# Altium project iMX6 Rex_V1I1.PrjPcb (part 2 of 3)

## Sheet [06] - CPU - HDMI, LVDS.SchDoc
size A2; DocumentNumber: 6; SheetNumber: 6; SheetTotal: 20
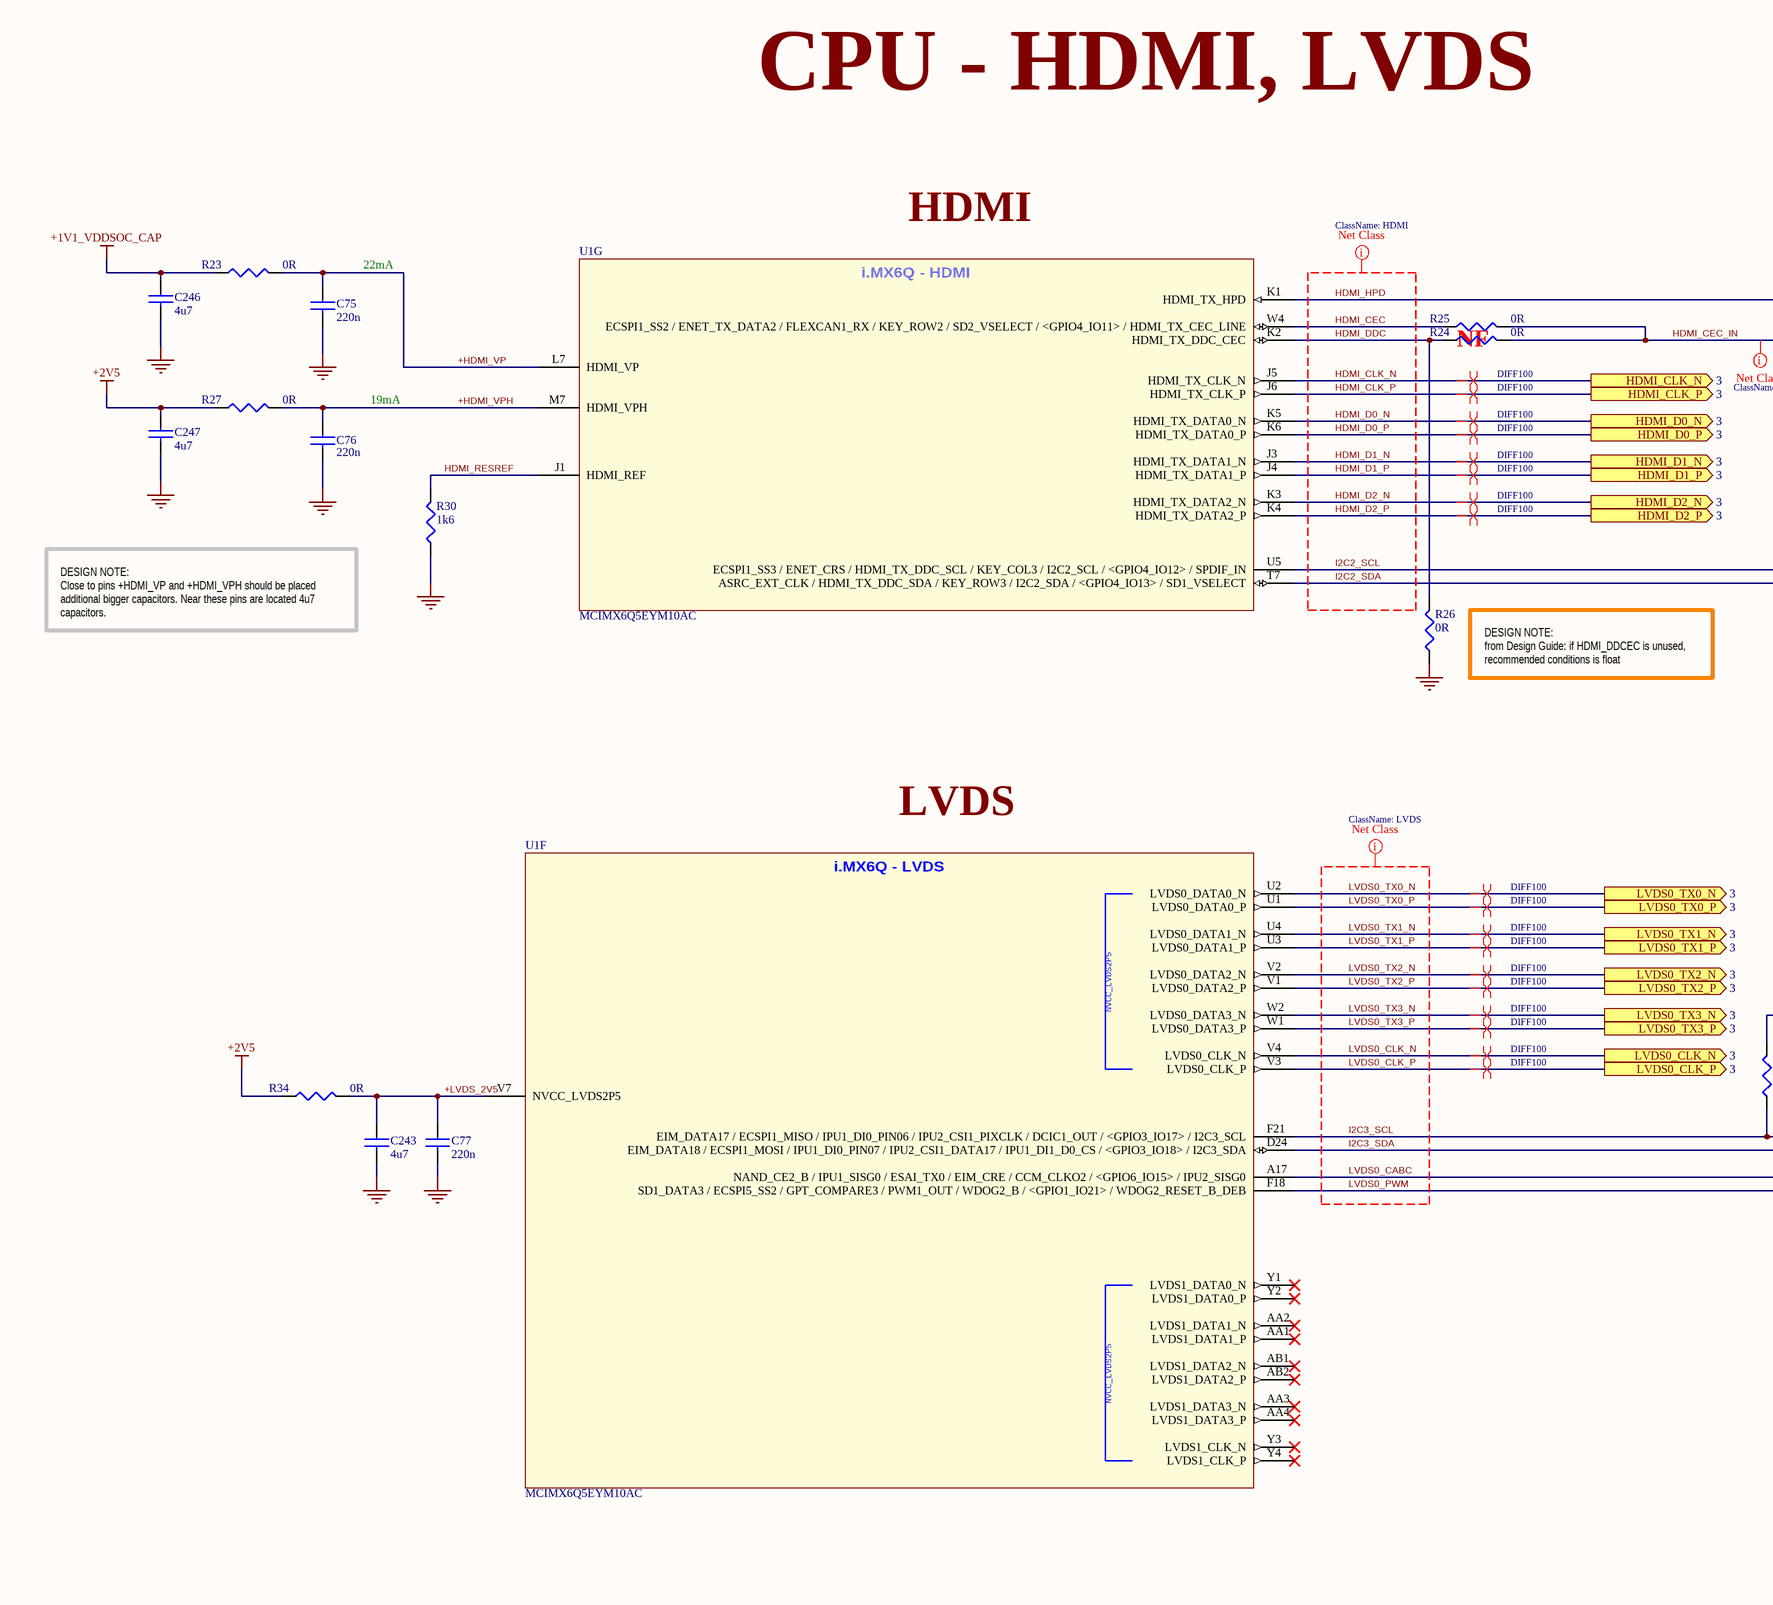
[diagram p4: [06] - CPU - HDMI, LVDS.SchDoc, left]
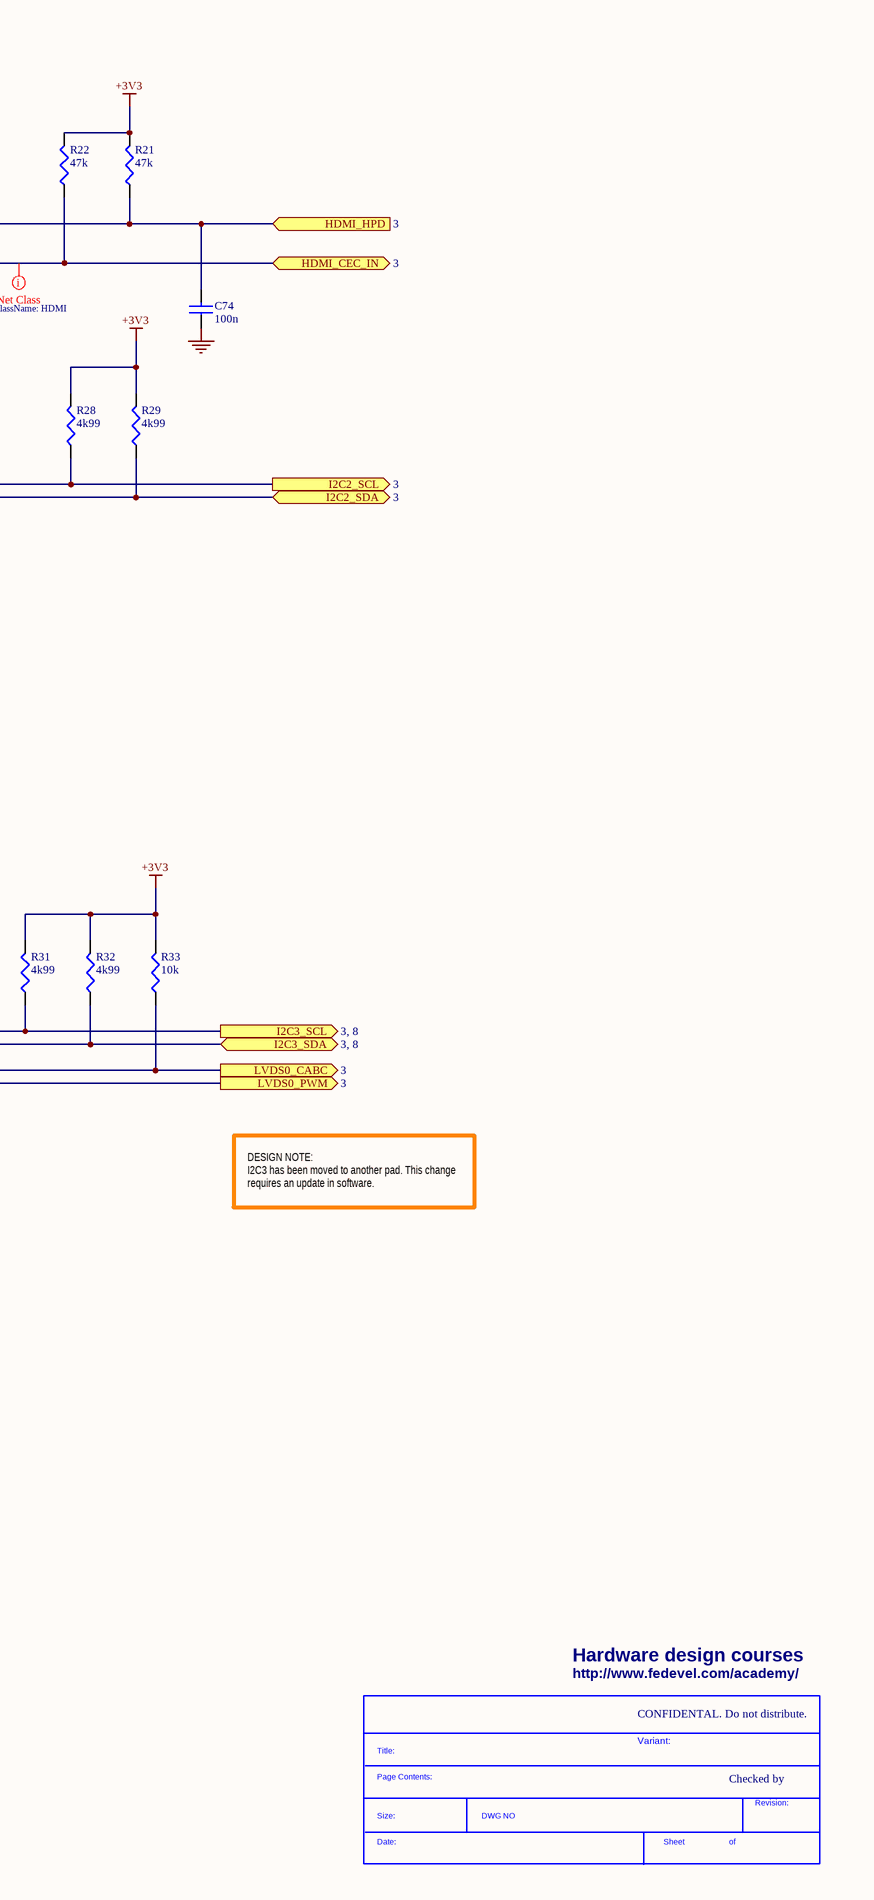
[diagram p5: [06] - CPU - HDMI, LVDS.SchDoc, right]

### Parts
(Parts that share a designator on the sheet are numbered #1, #2 ... from top to bottom, then left to right.)
*#3  SDTitleBlock  (value not drawn)  (graphical)
C74  100n  [C0402]
C75  220n  [C0402]
C76  220n  [C0402]
C77  220n  [C0402]
C243  4u7  [C0402]
C246  4u7  [C0402]
C247  4u7  [C0402]
R21  47k  [R0402]
R22  47k  [R0402]
R23  0R  [R0402]
R24  0R  [R0402]
R25  0R  [R0402]
R26  0R  [R0402]
R27  0R  [R0402]
R28  4k99  [R0402]
R29  4k99  [R0402]
R30  1k6  [R0402]
R31  4k99  [R0402]
R32  4k99  [R0402]
R33  10k  [R0402]
R34  0R  [R0402]
U1  MCIMX6Q5EYM10AC  [PBGA624]  (parts F,G of 15)

### Ports
HDMI_CEC_IN (bidir, see 3), HDMI_CLK_N (out, see 3), HDMI_CLK_P (out, see 3), HDMI_D0_N (out, see 3), HDMI_D0_P (out, see 3), HDMI_D1_N (out, see 3), HDMI_D1_P (out, see 3), HDMI_D2_N (out, see 3), HDMI_D2_P (out, see 3), HDMI_HPD (in, see 3), I2C2_SCL (out, see 3), I2C2_SDA (bidir, see 3), I2C3_SCL (see 3, 8), I2C3_SDA (bidir, see 3, 8), LVDS0_CABC (out, see 3), LVDS0_CLK_N (out, see 3), LVDS0_CLK_P (out, see 3), LVDS0_PWM (out, see 3), LVDS0_TX0_N (out, see 3), LVDS0_TX0_P (out, see 3), LVDS0_TX1_N (out, see 3), LVDS0_TX1_P (out, see 3), LVDS0_TX2_N (out, see 3), LVDS0_TX2_P (out, see 3), LVDS0_TX3_N (out, see 3), LVDS0_TX3_P (out, see 3)

### Nets
+1V1_VDDSOC_CAP: C246.1 R23.1
+2V5: C247.1 R27.1 R34.1
+3V3: R21.2 R22.2 R28.2 R29.2 R31.2 R32.2 R33.2
GND: C74.1 C75.2 C76.2 C77.2 C243.2 C246.2 C247.2 R26.1 R30.1
+HDMI_VP: C75.1 R23.2 U1.L7(HDMI_VP)
+HDMI_VPH: C76.1 R27.2 U1.M7(HDMI_VPH)
+LVDS_2V5: C77.1 C243.1 R34.2 U1.V7(NVCC_LVDS2P5)
HDMI_CEC: R25.1 U1.W4(ECSPI1_SS2_/_ENET_TX_DATA2_/_FLEXCAN1_RX_/_KEY_ROW2_/_SD2_VSELECT_/_<GPIO4_IO11>_/_HDMI_TX_CEC_LINE)
HDMI_CEC_IN: R22.1 R24.2 R25.2 ; port HDMI_CEC_IN
HDMI_CLK_N: U1.J5(HDMI_TX_CLK_N) ; port HDMI_CLK_N
HDMI_CLK_P: U1.J6(HDMI_TX_CLK_P) ; port HDMI_CLK_P
HDMI_D0_N: U1.K5(HDMI_TX_DATA0_N) ; port HDMI_D0_N
HDMI_D0_P: U1.K6(HDMI_TX_DATA0_P) ; port HDMI_D0_P
HDMI_D1_N: U1.J3(HDMI_TX_DATA1_N) ; port HDMI_D1_N
HDMI_D1_P: U1.J4(HDMI_TX_DATA1_P) ; port HDMI_D1_P
HDMI_D2_N: U1.K3(HDMI_TX_DATA2_N) ; port HDMI_D2_N
HDMI_D2_P: U1.K4(HDMI_TX_DATA2_P) ; port HDMI_D2_P
HDMI_DDC: R24.1 R26.2 U1.K2(HDMI_TX_DDC_CEC)
HDMI_HPD: C74.2 R21.1 U1.K1(HDMI_TX_HPD) ; port HDMI_HPD
HDMI_RESREF: R30.2 U1.J1(HDMI_REF)
I2C2_SCL: R28.1 U1.U5(ECSPI1_SS3_/_ENET_CRS_/_HDMI_TX_DDC_SCL_/_KEY_COL3_/_I2C2_SCL_/_<GPIO4_IO12>_/_SPDIF_IN) ; port I2C2_SCL
I2C2_SDA: R29.1 U1.T7(ASRC_EXT_CLK_/_HDMI_TX_DDC_SDA_/_KEY_ROW3_/_I2C2_SDA_/_<GPIO4_IO13>_/_SD1_VSELECT) ; port I2C2_SDA
I2C3_SCL: R31.1 U1.F21(EIM_DATA17_/_ECSPI1_MISO_/_IPU1_DI0_PIN06_/_IPU2_CSI1_PIXCLK_/_DCIC1_OUT_/_<GPIO3_IO17>_/_I2C3_SCL) ; port I2C3_SCL
I2C3_SDA: R32.1 U1.D24(EIM_DATA18_/_ECSPI1_MOSI_/_IPU1_DI0_PIN07_/_IPU2_CSI1_DATA17_/_IPU1_DI1_D0_CS_/_<GPIO3_IO18>_/_I2C3_SDA) ; port I2C3_SDA
LVDS0_CABC: R33.1 U1.A17(NAND_CE2_B_/_IPU1_SISG0_/_ESAI_TX0_/_EIM_CRE_/_CCM_CLKO2_/_<GPIO6_IO15>_/_IPU2_SISG0) ; port LVDS0_CABC
LVDS0_CLK_N: U1.V4(LVDS0_CLK_N) ; port LVDS0_CLK_N
LVDS0_CLK_P: U1.V3(LVDS0_CLK_P) ; port LVDS0_CLK_P
LVDS0_PWM: U1.F18(SD1_DATA3_/_ECSPI5_SS2_/_GPT_COMPARE3_/_PWM1_OUT_/_WDOG2_B_/_<GPIO1_IO21>_/_WDOG2_RESET_B_DEB) ; port LVDS0_PWM
LVDS0_TX0_N: U1.U2(LVDS0_DATA0_N) ; port LVDS0_TX0_N
LVDS0_TX0_P: U1.U1(LVDS0_DATA0_P) ; port LVDS0_TX0_P
LVDS0_TX1_N: U1.U4(LVDS0_DATA1_N) ; port LVDS0_TX1_N
LVDS0_TX1_P: U1.U3(LVDS0_DATA1_P) ; port LVDS0_TX1_P
LVDS0_TX2_N: U1.V2(LVDS0_DATA2_N) ; port LVDS0_TX2_N
LVDS0_TX2_P: U1.V1(LVDS0_DATA2_P) ; port LVDS0_TX2_P
LVDS0_TX3_N: U1.W2(LVDS0_DATA3_N) ; port LVDS0_TX3_N
LVDS0_TX3_P: U1.W1(LVDS0_DATA3_P) ; port LVDS0_TX3_P

Not connected (* = marked no-connect by the designer): U1 AA1(LVDS1_DATA1_P)* AA2(LVDS1_DATA1_N)* AA3(LVDS1_DATA3_N)* AA4(LVDS1_DATA3_P)* AB1(LVDS1_DATA2_N)* AB2(LVDS1_DATA2_P)* Y1(LVDS1_DATA0_N)* Y2(LVDS1_DATA0_P)* Y3(LVDS1_CLK_N)* Y4(LVDS1_CLK_P)*

### Layout directives
differential pair; net class DIFF100: HDMI_CLK_N, HDMI_CLK_P, HDMI_D0_N, HDMI_D0_P, HDMI_D1_N, HDMI_D1_P, HDMI_D2_N, HDMI_D2_P, LVDS0_CLK_N, LVDS0_CLK_P, LVDS0_TX0_N, LVDS0_TX0_P, LVDS0_TX1_N, LVDS0_TX1_P, LVDS0_TX2_N, LVDS0_TX2_P, LVDS0_TX3_N, LVDS0_TX3_P
net class LVDS: I2C3_SCL, I2C3_SDA, LVDS0_CABC, LVDS0_CLK_N, LVDS0_CLK_P, LVDS0_PWM, LVDS0_TX0_N, LVDS0_TX0_P, LVDS0_TX1_N, LVDS0_TX1_P, LVDS0_TX2_N, LVDS0_TX2_P, LVDS0_TX3_N, LVDS0_TX3_P
net class HDMI: HDMI_CEC, HDMI_CEC_IN, HDMI_CLK_N, HDMI_CLK_P, HDMI_D0_N, HDMI_D0_P, HDMI_D1_N, HDMI_D1_P, HDMI_D2_N, HDMI_D2_P, HDMI_DDC, HDMI_HPD, I2C2_SCL, I2C2_SDA

### Notes on the sheet
- CPU - HDMI, LVDS
- HDMI
- (near C75) 22mA
- NF
- 19mA
- DESIGN NOTE:
  Close to pins +HDMI_VP and +HDMI_VPH should be placed additional bigger capacitors. Near these pins are located 4u7 capacitors.
- DESIGN NOTE:
  from Design Guide: if HDMI_DDCEC is unused, recommended conditions is float
- LVDS
- DESIGN NOTE:
  I2C3 has been moved to another pad. This change requires an update in software.
- Hardware design courses
- http://www.fedevel.com/academy/
- CONFIDENTAL. Do not distribute.
- Variant:
- Checked by
- (in symbol MCIMX6Q5EYM10AC, part F) i.MX6Q - LVDS
- (in symbol MCIMX6Q5EYM10AC, part G) i.MX6Q - HDMI
- (in symbol SDTitleBlock) Title:; Page Contents:; Revision:; Size:; DWG NO; Date:; Sheet; of

### Library data of the parts
C74 = C1005X5R1H104K: CAP CER .10UF 50V X5R 10% 0402; Manufacturer: TDK Corporation; Capacitance: 0.1µF; Value: 100nF; .Checked PCB: used; Description: CAP CER 0.1UF 50V 10% X5R 0402; Category: Capacitors; Supplier Part Number: 445-5942-1-ND; Manufacturer Part Number: C1005X5R1H104K; Operating Temperature: -55°C ~ 85°C; Package / Case: 0402 (1005 Metric); Price 1k [$]: 0.02340; .Checked SCH: used; Voltage - Rated: 50V; Supplier: Digikey; Supplier 1: Digi-Key; Supplier Part Number 1: 445-5942-1-ND; RoHS: RoHS Compliant; Stock 1: 106926; Pricing 1: 1=0.27, 10=0.18, 100=0.072, 250=0.05176, 500=0.0369, 1000=0.027 (USD); Tolerance: ±10%; Temperature Coefficient: X5R; Mounting Type: Surface Mount, MLCC; Applications: General Purpose; Ratings: -; Size / Dimension: 0.039" L x 0.020" W (1.00mm x 0.50mm); Height - Seated (Max): -; Thickness (Max): 0.022" (0.55mm); Lead Spacing: -; Features: -; Packaging: Cut Tape (CT); Lead Style: -; ComponentLink1URL: http://www.tdk.co.jp/tefe02/e412_c.pdf; ComponentLink1Description: http://www.tdk.co.jp/tefe02/e412_c.pdf
C75-C77 = C1005X5R1E224M: CAP CER .22UF 25V X5R 20% 0402; Manufacturer: TDK Corporation; Capacitance: 0.22µF; Value: 220nF; .Checked PCB: used; Description: CAP CER 0.22UF 25V 20% X5R 0402; Category: Capacitors; Supplier Part Number: 445-5945-1-ND; Manufacturer Part Number: C1005X5R1E224M; Operating Temperature: -55°C ~ 85°C; Package / Case: 0402 (1005 Metric); Price 1k [$]: 0.02600; .Checked SCH: used; Voltage - Rated: 25V; Supplier: Digikey; Supplier 1: Digi-Key; Supplier Part Number 1: 445-5945-1-ND; RoHS: RoHS Compliant; Stock 1: 54593; Pricing 1: 1=0.3, 10=0.2, 100=0.08, 250=0.05752, 500=0.041, 1000=0.03 (USD); Tolerance: ±20%; Temperature Coefficient: X5R; Mounting Type: Surface Mount, MLCC; Applications: General Purpose; Ratings: -; Size / Dimension: 0.039" L x 0.020" W (1.00mm x 0.50mm); Height - Seated (Max): -; Thickness (Max): 0.022" (0.55mm); Lead Spacing: -; Features: -; Packaging: Cut Tape (CT); Lead Style: -; ComponentLink1URL: http://www.tdk.co.jp/tefe02/e412_c.pdf; ComponentLink1Description: http://www.tdk.co.jp/tefe02/e412_c.pdf
C243 C246 C247 = C1005X5R1A475M: CAP CER 4.7UF 10V 20% X5R 0402; Manufacturer: TDK Corporation; Capacitance: 4.7µF; .Checked PCB: RF; Supplier 1: Digi-Key; Supplier Part Number 1: 445-8023-1-ND; Manufacturer Part Number: C1005X5R1A475M; RoHS: RoHS Compliant; Category: Capacitors; Stock 1: 10140; Pricing 1: 1=0.53, 10=0.415, 100=0.25, 250=0.18752, 500=0.16, 1000=0.125, 5000=0.095 (USD); Voltage - Rated: 10V; Tolerance: ±20%; Temperature Coefficient: X5R; Mounting Type: Surface Mount, MLCC; Operating Temperature: -55°C ~ 85°C; Applications: General Purpose; Ratings: -; Package / Case: 0402 (1005 Metric); Size / Dimension: 0.039" L x 0.020" W (1.00mm x 0.50mm); Height - Seated (Max): -; Thickness (Max): -; Lead Spacing: -; Features: -; Packaging: Cut Tape (CT); Lead Style: -; ComponentLink1URL: http://www.tdk.com/pdf/general_B11.pdf; ComponentLink1Description: http://www.tdk.com/pdf/general_B11.pdf; .Checked SCH: RF
R21 R22 = RC0402FR-0747KL: RES 47.0K OHM 1/16W 1% 0402 SMD; Manufacturer: Yageo; Power (Watts): 0.063W, 1/16W; .Checked PCB: used; Temperature Coefficient: ±100ppm/°C; Category: Resistors; Supplier Part Number: 311-47.0KLRCT-ND; Manufacturer Part Number: RC0402FR-0747KL; Package / Case: 0402 (1005 Metric); Price 1k [$]: 0.01421; Resistance (Ohms): 47K; Tolerance: ±1%; Value: 47k; .Checked SCH: used; Supplier: Digikey; Supplier 1: Digi-Key; Supplier Part Number 1: 311-47.0KLRCT-ND; RoHS: RoHS Compliant; Stock 1: 1227580; Pricing 1: 10=0.014, 50=0.0104, 100=0.0079, 250=0.00584, 500=0.00432, 1000=0.00288 (USD); Composition: Thick Film; Features: -; Size / Dimension: 0.039" L x 0.020" W (1.00mm x 0.50mm); Height: 0.016" (0.40mm); Number of Terminations: 2; Packaging: Cut Tape (CT); ComponentLink1URL: http://www.yageo.com/documents/recent/PYu-RC0402_51_RoHS_L_6.pdf; ComponentLink1Description: http://www.yageo.com/documents/recent/PYu-RC0402_51_RoHS_L_6.pdf
R23-R27 R34 = RC0402JR-070RL: RES 0.0 OHM 1/16W 0402 SMD; Manufacturer: Yageo; Resistance (Ohms): 0.0; Power (Watts): 0.063W, 1/16W; Tolerance: Jumper; .Checked PCB: used; Category: Resistors; Supplier Part Number: 311-0.0JRCT-ND; Manufacturer Part Number: RC0402JR-070RL; Package / Case: 0402 (1005 Metric); Price 1k [$]: 0.01389; Value: 0R; .Checked SCH: used; Supplier: Digikey; Supplier 1: Digi-Key; Supplier Part Number 1: 311-0.0JRCT-ND; RoHS: RoHS Compliant; Stock 1: 1106330; Pricing 1: 10=0.012, 50=0.009, 100=0.0069, 250=0.00512, 500=0.0038, 1000=0.00253 (USD); Composition: Thick Film; Features: -; Temperature Coefficient: -; Size / Dimension: 0.039" L x 0.020" W (1.00mm x 0.50mm); Height: 0.016" (0.40mm); Number of Terminations: 2; Packaging: Cut Tape (CT); ComponentLink1URL: http://www.yageo.com/documents/recent/PYu-RC0402_51_RoHS_L_6.pdf; ComponentLink1Description: http://www.yageo.com/documents/recent/PYu-RC0402_51_RoHS_L_6.pdf
R28 R29 R31 R32 = RMCF0402FT4K99: RES TF 4.99K OHM 1% 1/16W 0402; Manufacturer: Stackpole Electronics Inc; Power (Watts): 0.063W, 1/16W; .Checked PCB: used; Temperature Coefficient: ±100ppm/°C; Category: Resistors; Supplier Part Number: RMCF0402FT4K99CT-ND; Manufacturer Part Number: RMCF0402FT4K99; Package / Case: 0402 (1005 Metric); Price 1k [$]: 0.00384; Resistance (Ohms): 4.99K; Tolerance: ±1%; Value: 4k99; .Checked SCH: used; Supplier: Digikey; Supplier 1: Digi-Key; Supplier Part Number 1: RMCF0402FT4K99CT-ND; RoHS: RoHS Compliant; Stock 1: 48509; Pricing 1: 1=0.04, 10=0.025, 50=0.0138, 100=0.0105, 250=0.0078, 500=0.00576, 1000=0.00384 (USD); Composition: Thick Film; Features: -; Size / Dimension: 0.039" L x 0.020" W (1.00mm x 0.50mm); Height: 0.016" (0.40mm); Number of Terminations: 2; Packaging: Cut Tape (CT); ComponentLink1URL: http://www.seielect.com/Catalog/SEI-RMCF.pdf; ComponentLink1Description: http://www.seielect.com/Catalog/SEI-RMCF.pdf
R30 = ERJ-2RKF1601X: RES 1.6K OHM 1/10W 1% 0402 SMD; Manufacturer: Panasonic Electronic Components; Power (Watts): 0.1W, 1/10W; Temperature Coefficient: ±100ppm/°C; .Creator: MM; .Checked PCB: RF, used by MM; .Checked SCH: MM, checked by RF; Supplier 1: Digi-Key; Manufacturer Part Number: ERJ-2RKF1601X; RoHS: RoHS Compliant; Category: Resistors; Stock 1: 89488; Pricing 1: 1=0.1, 50=0.0242, 100=0.0184, 250=0.01364, 500=0.01008, 1000=0.00672, 5000=0.00473 (USD); Resistance (Ohms): 1.6k; Composition: Thick Film; Features: -; Tolerance: ±1%; Package / Case: 0402 (1005 Metric); Supplier Device Package: 0402; Size / Dimension: 0.039" L x 0.020" W (1.00mm x 0.50mm); Height: 0.016" (0.40mm); Number of Terminations: 2; Packaging: Cut Tape (CT); ComponentLink1URL: http://industrial.panasonic.com/www-cgi/jvcr13pz.cgi?E+PZ+3+AOA0002+ERJ2RKF1601X+7+WW; ComponentLink1Description: http://industrial.panasonic.com/www-cgi/jvcr13pz.cgi?E+PZ+3+AOA0002+ERJ2RKF1601X+7+WW; Supplier Part Number 1: P1.60KLCT-ND
R33 = RC0402FR-0710KL: RES 10.0K OHM 1/16W 1% 0402 SMD; Manufacturer: Yageo; Power (Watts): 0.063W, 1/16W; .Checked PCB: used; Temperature Coefficient: ±100ppm/°C; Category: Resistors; Supplier Part Number: 311-10.0KLRCT-ND; Manufacturer Part Number: RC0402FR-0710KL; Package / Case: 0402 (1005 Metric); Price 1k [$]: 0.01421; Resistance (Ohms): 10K; Tolerance: ±1%; Value: 10k; .Checked SCH: used; Supplier: Digikey; Supplier 1: Digi-Key; Supplier Part Number 1: 311-10.0KLRCT-ND; RoHS: RoHS Compliant; Stock 1: 2916495; Pricing 1: 10=0.014, 50=0.0104, 100=0.0079, 250=0.00584, 500=0.00432, 1000=0.00288 (USD); Composition: Thick Film; Features: -; Size / Dimension: 0.039" L x 0.020" W (1.00mm x 0.50mm); Height: 0.016" (0.40mm); Number of Terminations: 2; Packaging: Cut Tape (CT); ComponentLink1URL: http://www.yageo.com/documents/recent/PYu-RC0402_51_RoHS_L_6.pdf; ComponentLink1Description: http://www.yageo.com/documents/recent/PYu-RC0402_51_RoHS_L_6.pdf
U1 = MCIMX6Q5EYM10AC: as U1 on sheet [04] - CPU - DDR3, DDR3 MEM; Supplier 1: Digi-Key; Manufacturer Part Number: MCIMX6Q5EYM10AC; RoHS: RoHS Compliant; Category: Integrated Circuits (ICs); Stock 1: 0; Pricing 1: 1=54.98, 10=51.922, 25=48.868, 100=30.5424 (USD); Program Memory Size: -; EEPROM Size: -; Data Converters: -; Operating Temperature: -20°C ~ 105°C; Package / Case: 624-FBGA, FCBGA; Packaging: Tray; ComponentLink1URL: http://cache.freescale.com/files/32bit/doc/data_sheet/IMX6DQCEC.pdf; ComponentLink1Description: http://cache.freescale.com/files/32bit/doc/data_sheet/IMX6DQCEC.pdf; Supplier Part Number 1: MCIMX6Q5EYM10AC-ND; .Checked SCH: MM

## Sheet [07] - CPU - USB, ETHERNET.SchDoc
size A2; DocumentNumber: 7; SheetNumber: 7; SheetTotal: 20
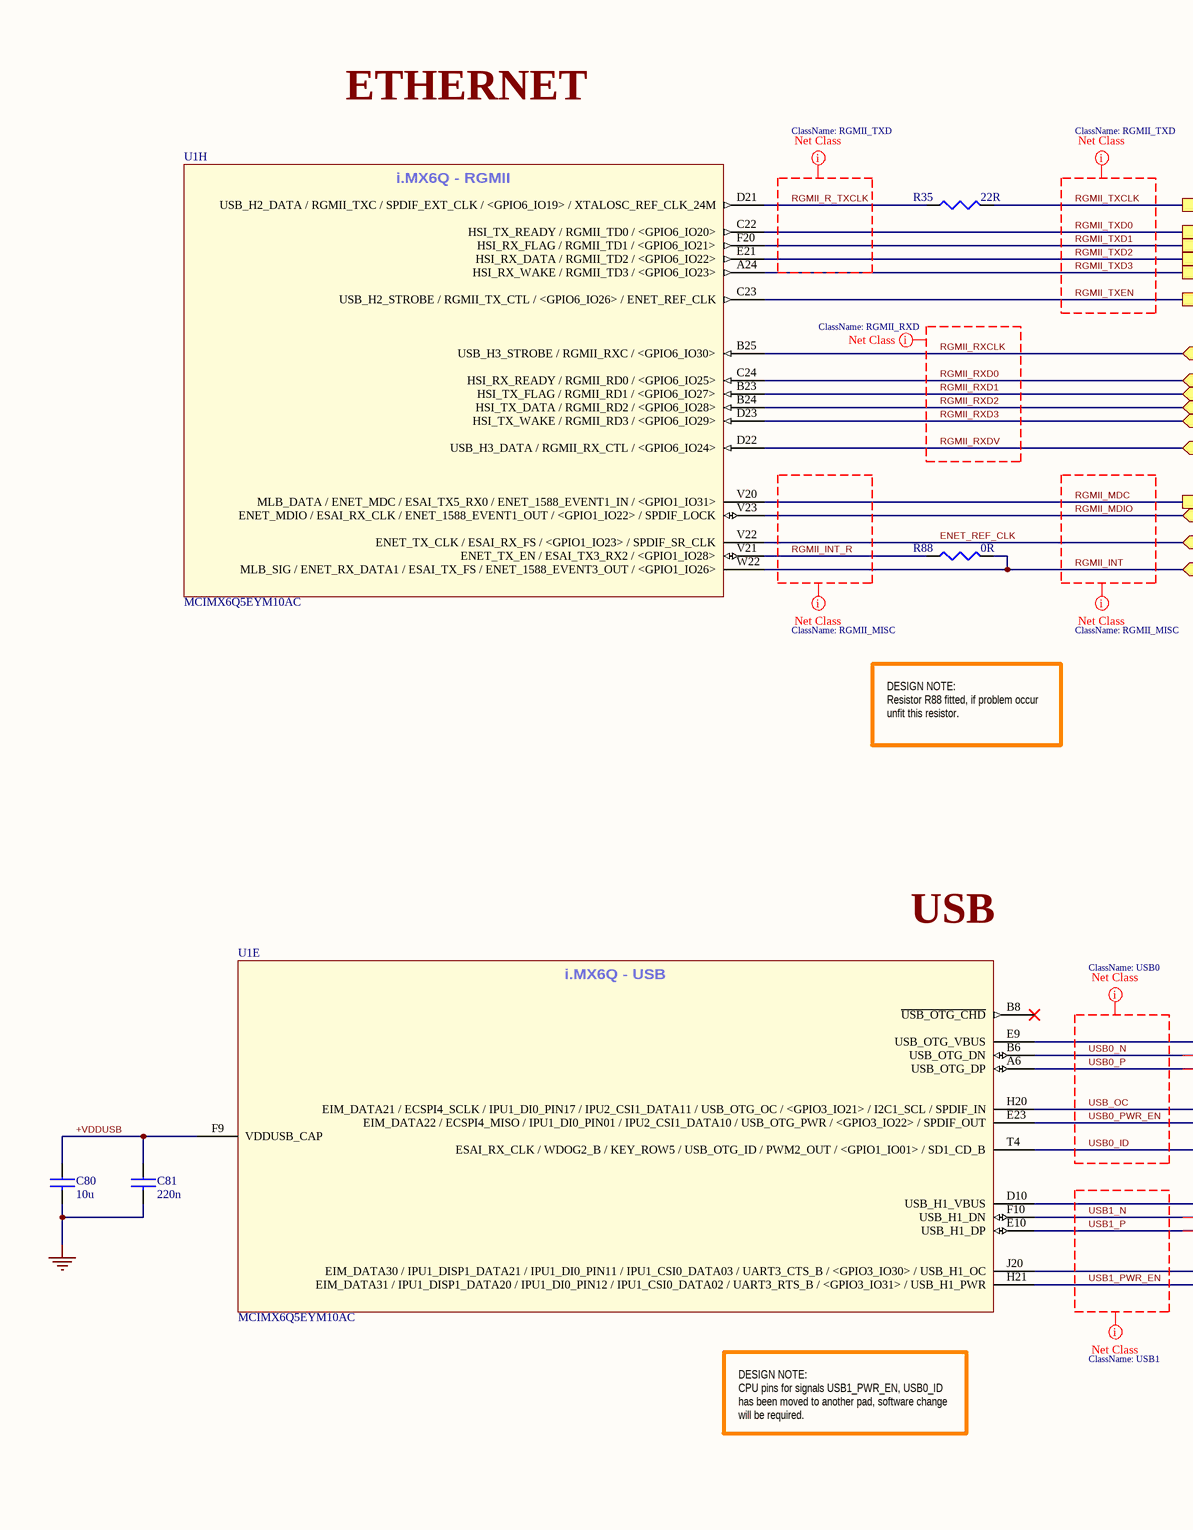
[diagram p6: [07] - CPU - USB, ETHERNET.SchDoc, left]
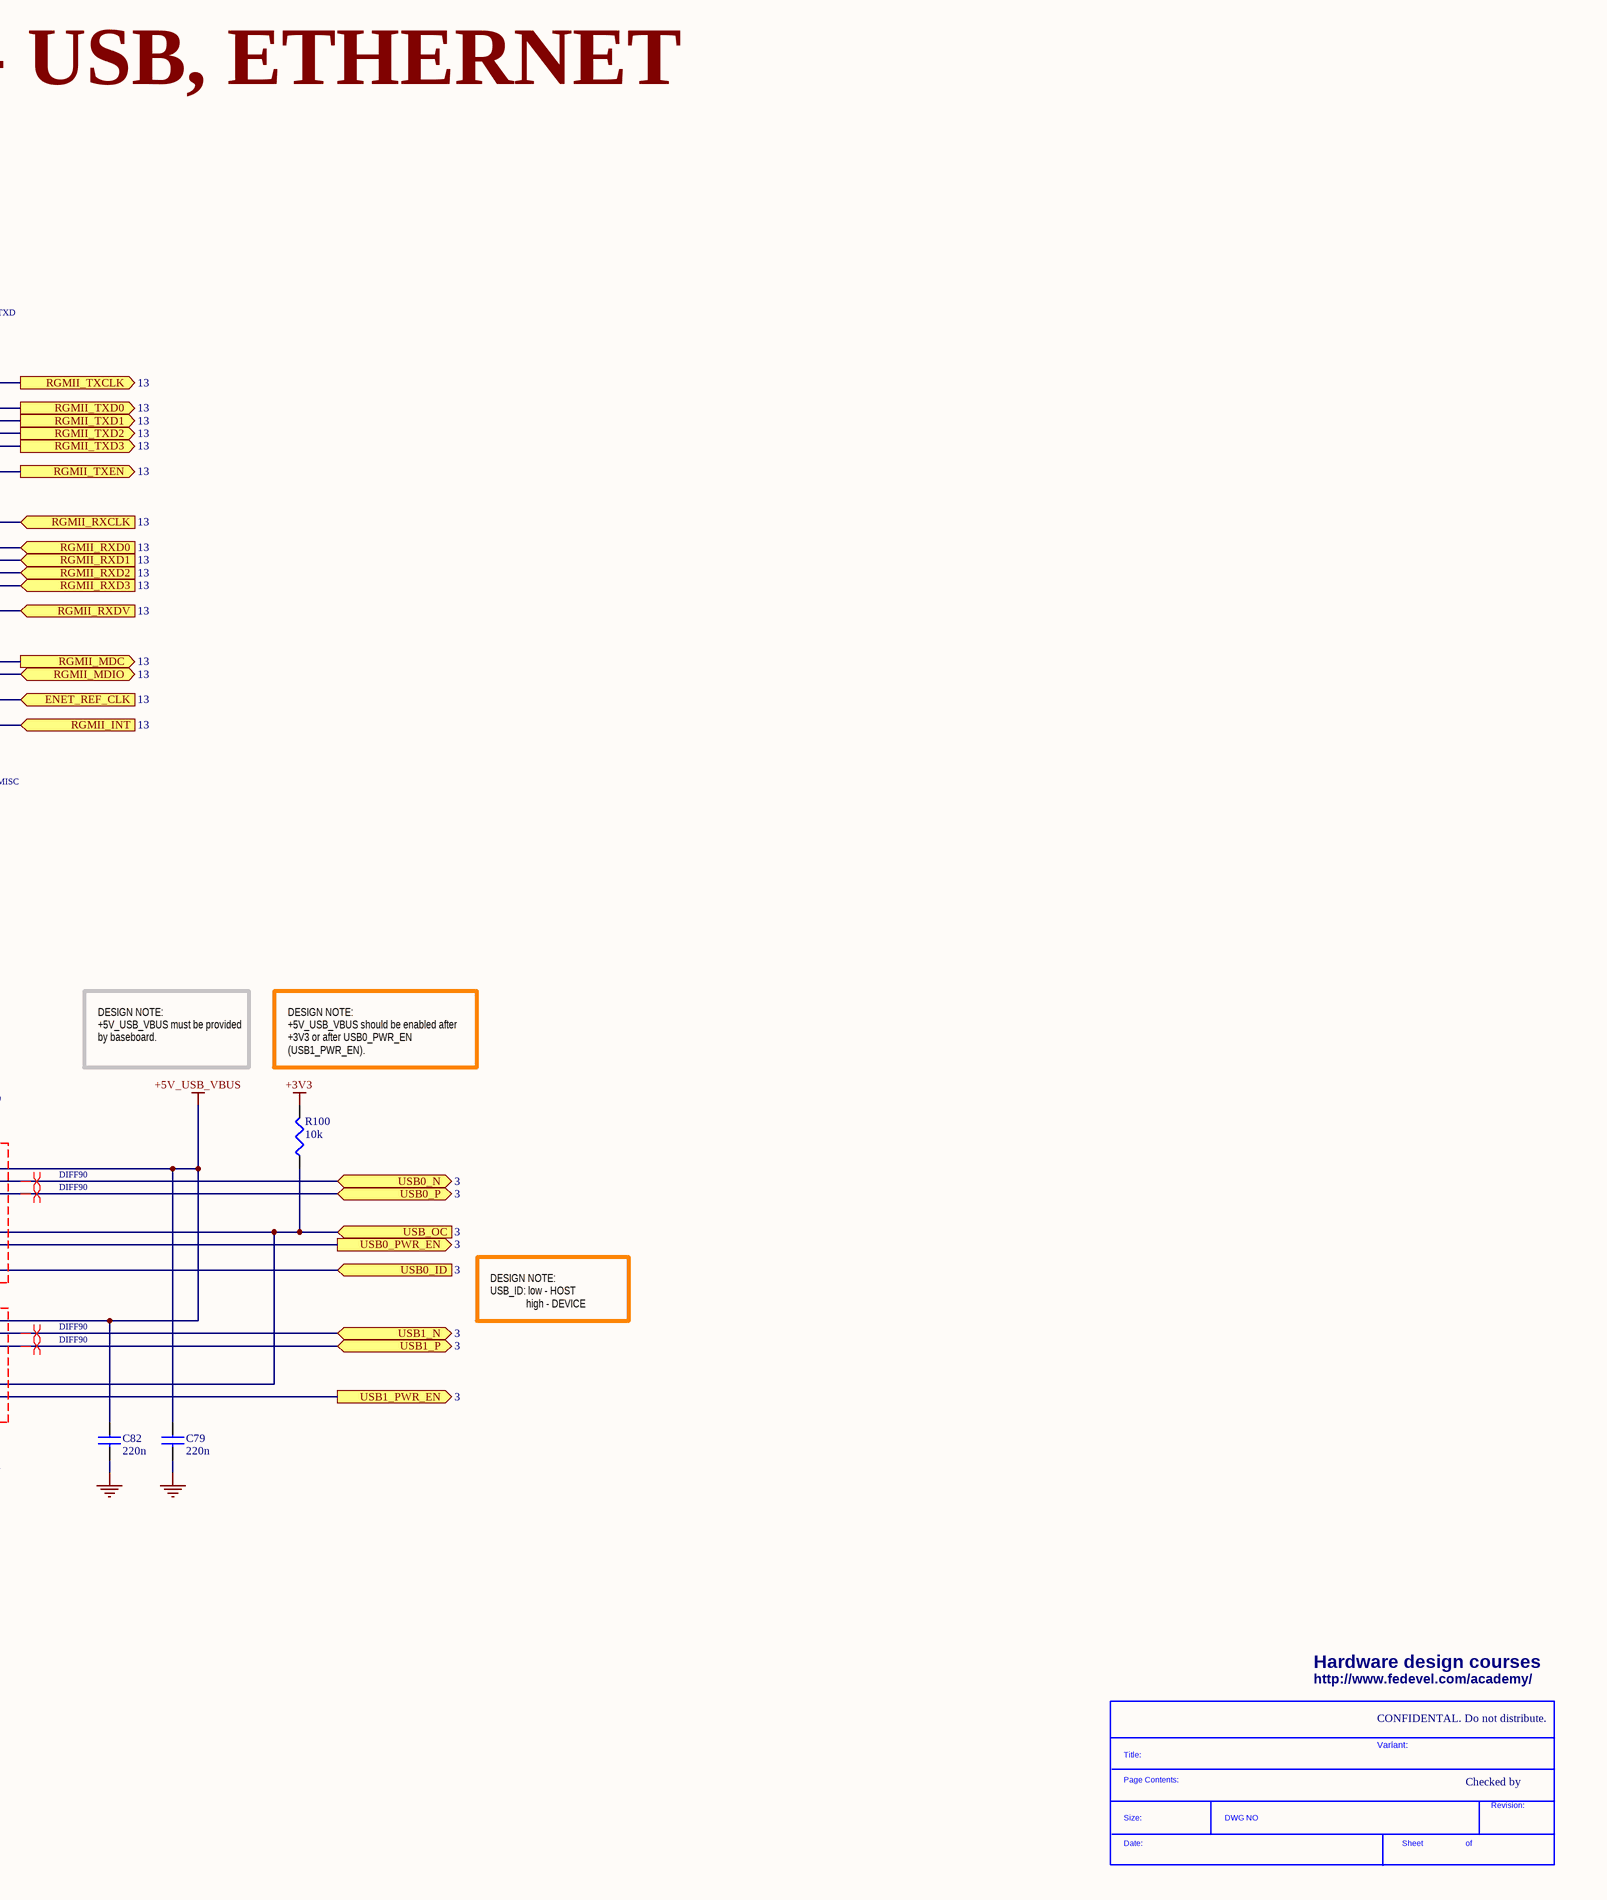
[diagram p7: [07] - CPU - USB, ETHERNET.SchDoc, right]

### Parts
(Parts that share a designator on the sheet are numbered #1, #2 ... from top to bottom, then left to right.)
*#4  SDTitleBlock  (value not drawn)  (graphical)
C79  220n  [C0402]
C80  10u  [C0603]
C81  220n  [C0402]
C82  220n  [C0402]
R35  22R  [R0402]
R88  0R  [R0402]
R100  10k  [R0402]
U1  MCIMX6Q5EYM10AC  [PBGA624]  (parts E,H of 15)

### Ports
ENET_REF_CLK (in, see 13), RGMII_INT (in, see 13), RGMII_MDC (out, see 13), RGMII_MDIO (bidir, see 13), RGMII_RXCLK (in, see 13), RGMII_RXD0 (in, see 13), RGMII_RXD1 (in, see 13), RGMII_RXD2 (in, see 13), RGMII_RXD3 (in, see 13), RGMII_RXDV (in, see 13), RGMII_TXCLK (out, see 13), RGMII_TXD0 (out, see 13), RGMII_TXD1 (out, see 13), RGMII_TXD2 (out, see 13), RGMII_TXD3 (out, see 13), RGMII_TXEN (out, see 13), USB0_ID (in, see 3), USB0_N (bidir, see 3), USB0_P (bidir, see 3), USB0_PWR_EN (out, see 3), USB1_N (bidir, see 3), USB1_P (bidir, see 3), USB1_PWR_EN (out, see 3), USB_OC (in, see 3)

### Nets
+3V3: R100.2
+5V_USB_VBUS: C79.1 C82.1 U1.D10(USB_H1_VBUS) U1.E9(USB_OTG_VBUS)
GND: C79.2 C80.2 C81.2 C82.2
+VDDUSB: C80.1 C81.1 U1.F9(VDDUSB_CAP)
ENET_REF_CLK: U1.V22(ENET_TX_CLK_/_ESAI_RX_FS_/_<GPIO1_IO23>_/_SPDIF_SR_CLK) ; port ENET_REF_CLK
RGMII_INT: R88.2 U1.W22(MLB_SIG_/_ENET_RX_DATA1_/_ESAI_TX_FS_/_ENET_1588_EVENT3_OUT_/_<GPIO1_IO26>) ; port RGMII_INT
RGMII_INT_R: R88.1 U1.V21(ENET_TX_EN_/_ESAI_TX3_RX2_/_<GPIO1_IO28>)
RGMII_MDC: U1.V20(MLB_DATA_/_ENET_MDC_/_ESAI_TX5_RX0_/_ENET_1588_EVENT1_IN_/_<GPIO1_IO31>) ; port RGMII_MDC
RGMII_MDIO: U1.V23(ENET_MDIO_/_ESAI_RX_CLK_/_ENET_1588_EVENT1_OUT_/_<GPIO1_IO22>_/_SPDIF_LOCK) ; port RGMII_MDIO
RGMII_R_TXCLK: R35.1 U1.D21(USB_H2_DATA_/_RGMII_TXC_/_SPDIF_EXT_CLK_/_<GPIO6_IO19>_/_XTALOSC_REF_CLK_24M)
RGMII_RXCLK: U1.B25(USB_H3_STROBE_/_RGMII_RXC_/_<GPIO6_IO30>) ; port RGMII_RXCLK
RGMII_RXD0: U1.C24(HSI_RX_READY_/_RGMII_RD0_/_<GPIO6_IO25>) ; port RGMII_RXD0
RGMII_RXD1: U1.B23(HSI_TX_FLAG_/_RGMII_RD1_/_<GPIO6_IO27>) ; port RGMII_RXD1
RGMII_RXD2: U1.B24(HSI_TX_DATA_/_RGMII_RD2_/_<GPIO6_IO28>) ; port RGMII_RXD2
RGMII_RXD3: U1.D23(HSI_TX_WAKE_/_RGMII_RD3_/_<GPIO6_IO29>) ; port RGMII_RXD3
RGMII_RXDV: U1.D22(USB_H3_DATA_/_RGMII_RX_CTL_/_<GPIO6_IO24>) ; port RGMII_RXDV
RGMII_TXCLK: R35.2 ; port RGMII_TXCLK
RGMII_TXD0: U1.C22(HSI_TX_READY_/_RGMII_TD0_/_<GPIO6_IO20>) ; port RGMII_TXD0
RGMII_TXD1: U1.F20(HSI_RX_FLAG_/_RGMII_TD1_/_<GPIO6_IO21>) ; port RGMII_TXD1
RGMII_TXD2: U1.E21(HSI_RX_DATA_/_RGMII_TD2_/_<GPIO6_IO22>) ; port RGMII_TXD2
RGMII_TXD3: U1.A24(HSI_RX_WAKE_/_RGMII_TD3_/_<GPIO6_IO23>) ; port RGMII_TXD3
RGMII_TXEN: U1.C23(USB_H2_STROBE_/_RGMII_TX_CTL_/_<GPIO6_IO26>_/_ENET_REF_CLK) ; port RGMII_TXEN
USB0_ID: U1.T4(ESAI_RX_CLK_/_WDOG2_B_/_KEY_ROW5_/_USB_OTG_ID_/_PWM2_OUT_/_<GPIO1_IO01>_/_SD1_CD_B) ; port USB0_ID
USB0_N: U1.B6(USB_OTG_DN) ; port USB0_N
USB0_P: U1.A6(USB_OTG_DP) ; port USB0_P
USB0_PWR_EN: U1.E23(EIM_DATA22_/_ECSPI4_MISO_/_IPU1_DI0_PIN01_/_IPU2_CSI1_DATA10_/_USB_OTG_PWR_/_<GPIO3_IO22>_/_SPDIF_OUT) ; port USB0_PWR_EN
USB1_N: U1.F10(USB_H1_DN) ; port USB1_N
USB1_P: U1.E10(USB_H1_DP) ; port USB1_P
USB1_PWR_EN: U1.H21(EIM_DATA31_/_IPU1_DISP1_DATA20_/_IPU1_DI0_PIN12_/_IPU1_CSI0_DATA02_/_UART3_RTS_B_/_<GPIO3_IO31>_/_USB_H1_PWR) ; port USB1_PWR_EN
USB_OC: R100.1 U1.H20(EIM_DATA21_/_ECSPI4_SCLK_/_IPU1_DI0_PIN17_/_IPU2_CSI1_DATA11_/_USB_OTG_OC_/_<GPIO3_IO21>_/_I2C1_SCL_/_SPDIF_IN) U1.J20(EIM_DATA30_/_IPU1_DISP1_DATA21_/_IPU1_DI0_PIN11_/_IPU1_CSI0_DATA03_/_UART3_CTS_B_/_<GPIO3_IO30>_/_USB_H1_OC) ; port USB_OC

Not connected (* = marked no-connect by the designer): U1 B8(~{USB_OTG_CHD})*

### Layout directives
net class RGMII_MISC: RGMII_INT, RGMII_INT_R, RGMII_MDC, RGMII_MDIO
differential pair; net class DIFF90: USB0_N, USB0_P, USB1_N, USB1_P
net class USB0: USB0_ID, USB0_N, USB0_P, USB0_PWR_EN, USB_OC
net class USB1: USB1_N, USB1_P, USB1_PWR_EN
net class RGMII_TXD: RGMII_R_TXCLK, RGMII_TXCLK, RGMII_TXD0, RGMII_TXD1, RGMII_TXD2, RGMII_TXD3, RGMII_TXEN
net class RGMII_RXD: RGMII_RXCLK, RGMII_RXD0, RGMII_RXD1, RGMII_RXD2, RGMII_RXD3, RGMII_RXDV

### Notes on the sheet
- CPU - USB, ETHERNET
- ETHERNET
- DESIGN NOTE:
  Resistor R88 fitted, if problem occur unfit this resistor.
- USB
- DESIGN NOTE:
  +5V_USB_VBUS must be provided by baseboard.
- DESIGN NOTE:
  +5V_USB_VBUS should be enabled after +3V3 or after USB0_PWR_EN (USB1_PWR_EN).
- DESIGN NOTE:
  USB_ID: low - HOST
  high - DEVICE
- DESIGN NOTE:
  CPU pins for signals USB1_PWR_EN, USB0_ID has been moved to another pad, software change will be required.
- Hardware design courses
- http://www.fedevel.com/academy/
- CONFIDENTAL. Do not distribute.
- Variant:
- Checked by
- (in symbol MCIMX6Q5EYM10AC, part E) i.MX6Q - USB
- (in symbol MCIMX6Q5EYM10AC, part H) i.MX6Q - RGMII
- (in symbol SDTitleBlock) Title:; Page Contents:; Revision:; Size:; DWG NO; Date:; Sheet; of

### Library data of the parts
C79 C81 C82 = C1005X5R1E224M: as C75 on sheet [06] - CPU - HDMI, LVDS; Category: Capacitors; Supplier Part Number: 445-5945-1-ND; Manufacturer Part Number: C1005X5R1E224M; Operating Temperature: -55°C ~ 85°C; Package / Case: 0402 (1005 Metric); Price 1k [$]: 0.02600; .Checked SCH: used; Voltage - Rated: 25V; Supplier: Digikey; Supplier 1: Digi-Key; Supplier Part Number 1: 445-5945-1-ND; RoHS: RoHS Compliant; Stock 1: 54593; Pricing 1: 1=0.3, 10=0.2, 100=0.08, 250=0.05752, 500=0.041, 1000=0.03 (USD); Tolerance: ±20%; Temperature Coefficient: X5R; Mounting Type: Surface Mount, MLCC; Applications: General Purpose; Ratings: -; Size / Dimension: 0.039" L x 0.020" W (1.00mm x 0.50mm); Height - Seated (Max): -; Thickness (Max): 0.022" (0.55mm); Lead Spacing: -; Features: -; Packaging: Cut Tape (CT); Lead Style: -; ComponentLink1URL: http://www.tdk.co.jp/tefe02/e412_c.pdf; ComponentLink1Description: http://www.tdk.co.jp/tefe02/e412_c.pdf
C80 = C1608X5R0J106M: CAP CER 10UF 6.3V X5R 20% 0603; Manufacturer: TDK Corporation; Capacitance: 10µF; Value: 10µF; .Checked PCB: used; Description: CAP CER 10UF 6.3V 20% X5R 0603; Category: Capacitors; Supplier Part Number: 445-4112-1-ND; Manufacturer Part Number: C1608X5R0J106M; Operating Temperature: -55°C ~ 85°C; Package / Case: 0603 (1608 Metric); Price 1k [$]: 0.08580; .Checked SCH: used; Voltage - Rated: 6.3V; Features: Low ESR; Supplier: Digikey; Supplier 1: Digi-Key; Supplier Part Number 1: 445-4112-1-ND; RoHS: RoHS Compliant; Stock 1: 48157; Pricing 1: 1=0.46, 10=0.363, 100=0.1898, 250=0.14024, 500=0.1089, 1000=0.0858 (USD); Tolerance: ±20%; Temperature Coefficient: X5R; Mounting Type: Surface Mount, MLCC; Applications: General Purpose; Ratings: -; Size / Dimension: 0.063" L x 0.031" W (1.60mm x 0.80mm); Height - Seated (Max): -; Thickness (Max): 0.037" (0.95mm); Lead Spacing: -; Packaging: Cut Tape (CT); Lead Style: -; ComponentLink1URL: http://www.tdk.com/pdf/general_B11.pdf; ComponentLink1Description: http://www.tdk.com/pdf/general_B11.pdf
R35 = RC0402FR-0722RL: RES 22.0 OHM 1/16W 1% 0402 SMD; Manufacturer: Yageo; Resistance (Ohms): 22; Power (Watts): 0.063W, 1/16W; .Checked PCB: used; Temperature Coefficient: ±100ppm/°C; Category: Resistors; Manufacturer Part Number: RC0402FR-0722RL; Package / Case: 0402 (1005 Metric); Price 1k [$]: 0.01421; Tolerance: ±1%; Value: 22R; .Checked SCH: used; Supplier Part Number: 311-22.0LRCT-ND; Supplier: Digikey; Supplier 1: Digi-Key; Supplier Part Number 1: 311-22.0LRCT-ND; RoHS: RoHS Compliant; Stock 1: 943800; Pricing 1: 10=0.014, 50=0.0104, 100=0.0079, 250=0.00584, 500=0.00432, 1000=0.00288 (USD); Composition: Thick Film; Features: -; Size / Dimension: 0.039" L x 0.020" W (1.00mm x 0.50mm); Height: 0.016" (0.40mm); Number of Terminations: 2; Packaging: Cut Tape (CT); ComponentLink1URL: http://www.yageo.com/documents/recent/PYu-RC0402_51_RoHS_L_6.pdf; ComponentLink1Description: http://www.yageo.com/documents/recent/PYu-RC0402_51_RoHS_L_6.pdf
R88 = RC0402JR-070RL: as R23 on sheet [06] - CPU - HDMI, LVDS; Category: Resistors; Supplier Part Number: 311-0.0JRCT-ND; Manufacturer Part Number: RC0402JR-070RL; Package / Case: 0402 (1005 Metric); Price 1k [$]: 0.01389; Value: 0R; .Checked SCH: used; Supplier: Digikey; Supplier 1: Digi-Key; Supplier Part Number 1: 311-0.0JRCT-ND; RoHS: RoHS Compliant; Stock 1: 1106330; Pricing 1: 10=0.012, 50=0.009, 100=0.0069, 250=0.00512, 500=0.0038, 1000=0.00253 (USD); Composition: Thick Film; Features: -; Temperature Coefficient: -; Size / Dimension: 0.039" L x 0.020" W (1.00mm x 0.50mm); Height: 0.016" (0.40mm); Number of Terminations: 2; Packaging: Cut Tape (CT); ComponentLink1URL: http://www.yageo.com/documents/recent/PYu-RC0402_51_RoHS_L_6.pdf; ComponentLink1Description: http://www.yageo.com/documents/recent/PYu-RC0402_51_RoHS_L_6.pdf
R100 = RC0402FR-0710KL: as R33 on sheet [06] - CPU - HDMI, LVDS; Category: Resistors; Supplier Part Number: 311-10.0KLRCT-ND; Manufacturer Part Number: RC0402FR-0710KL; Package / Case: 0402 (1005 Metric); Price 1k [$]: 0.01421; Resistance (Ohms): 10K; Tolerance: ±1%; Value: 10k; .Checked SCH: used; Supplier: Digikey; Supplier 1: Digi-Key; Supplier Part Number 1: 311-10.0KLRCT-ND; RoHS: RoHS Compliant; Stock 1: 2916495; Pricing 1: 10=0.014, 50=0.0104, 100=0.0079, 250=0.00584, 500=0.00432, 1000=0.00288 (USD); Composition: Thick Film; Features: -; Size / Dimension: 0.039" L x 0.020" W (1.00mm x 0.50mm); Height: 0.016" (0.40mm); Number of Terminations: 2; Packaging: Cut Tape (CT); ComponentLink1URL: http://www.yageo.com/documents/recent/PYu-RC0402_51_RoHS_L_6.pdf; ComponentLink1Description: http://www.yageo.com/documents/recent/PYu-RC0402_51_RoHS_L_6.pdf
U1 = MCIMX6Q5EYM10AC: as U1 on sheet [04] - CPU - DDR3, DDR3 MEM; Supplier 1: Digi-Key; Manufacturer Part Number: MCIMX6Q5EYM10AC; RoHS: RoHS Compliant; Category: Integrated Circuits (ICs); Stock 1: 0; Pricing 1: 1=54.98, 10=51.922, 25=48.868, 100=30.5424 (USD); Program Memory Size: -; EEPROM Size: -; Data Converters: -; Operating Temperature: -20°C ~ 105°C; Package / Case: 624-FBGA, FCBGA; Packaging: Tray; ComponentLink1URL: http://cache.freescale.com/files/32bit/doc/data_sheet/IMX6DQCEC.pdf; ComponentLink1Description: http://cache.freescale.com/files/32bit/doc/data_sheet/IMX6DQCEC.pdf; Supplier Part Number 1: MCIMX6Q5EYM10AC-ND; .Checked SCH: MM

## Sheet [08] - CPU - SPI, I2C, SD, MMC.SchDoc
size A2; DocumentNumber: 8; SheetNumber: 8; SheetTotal: 20
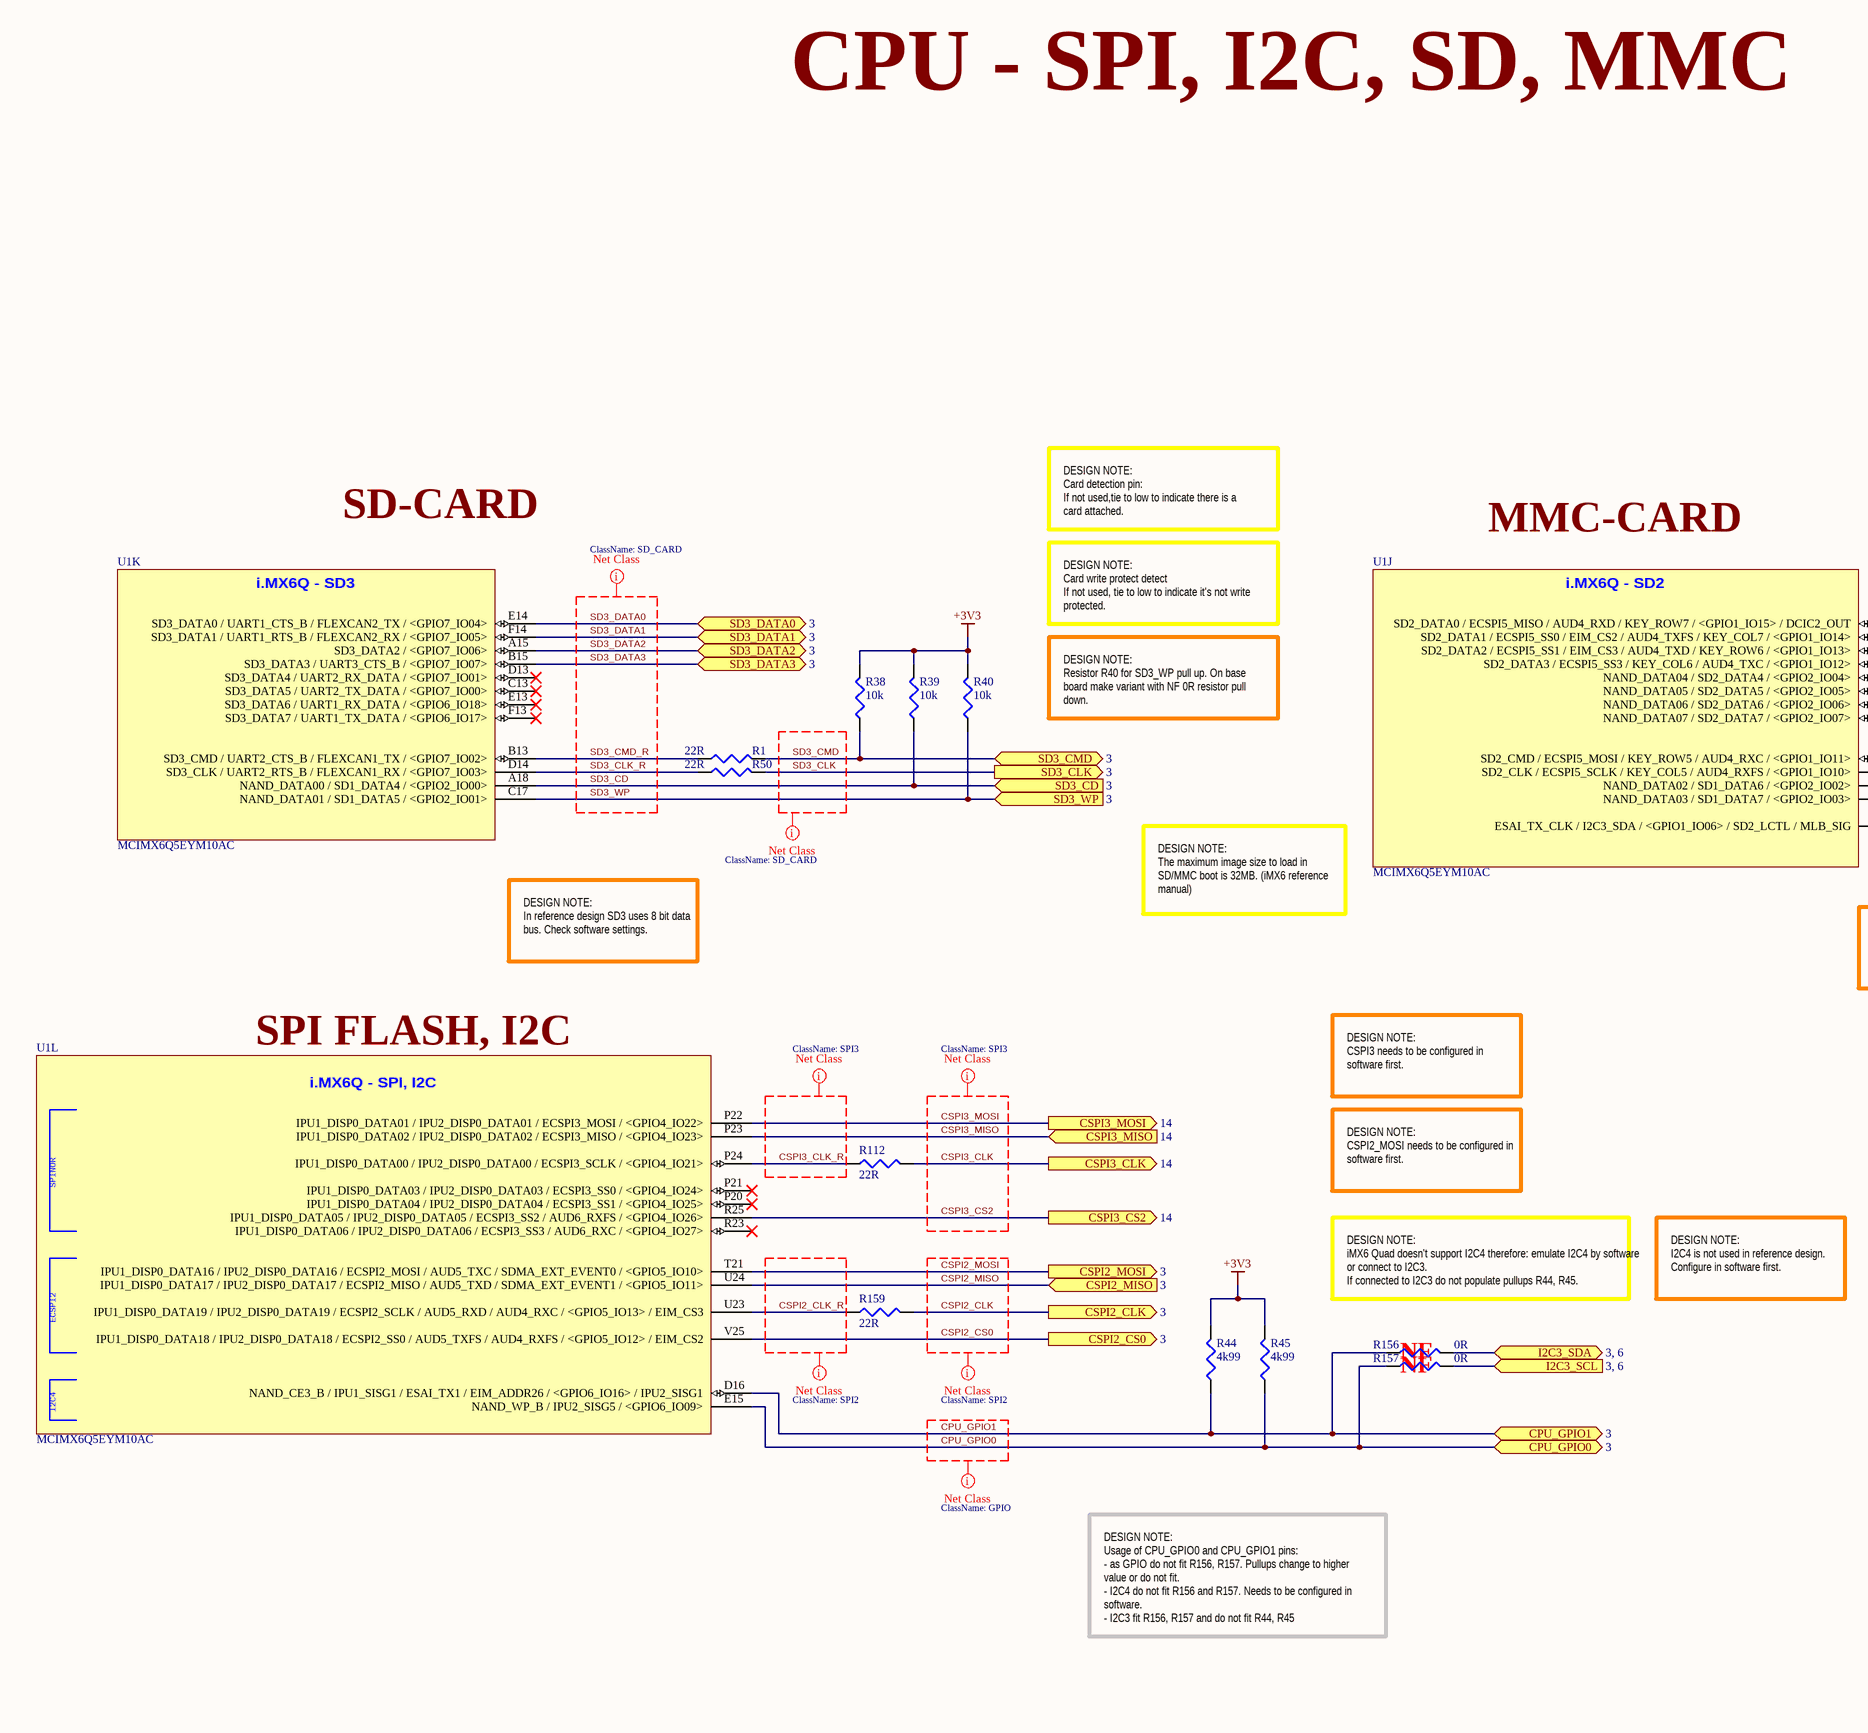
[diagram p8: [08] - CPU - SPI, I2C, SD, MMC.SchDoc, left]
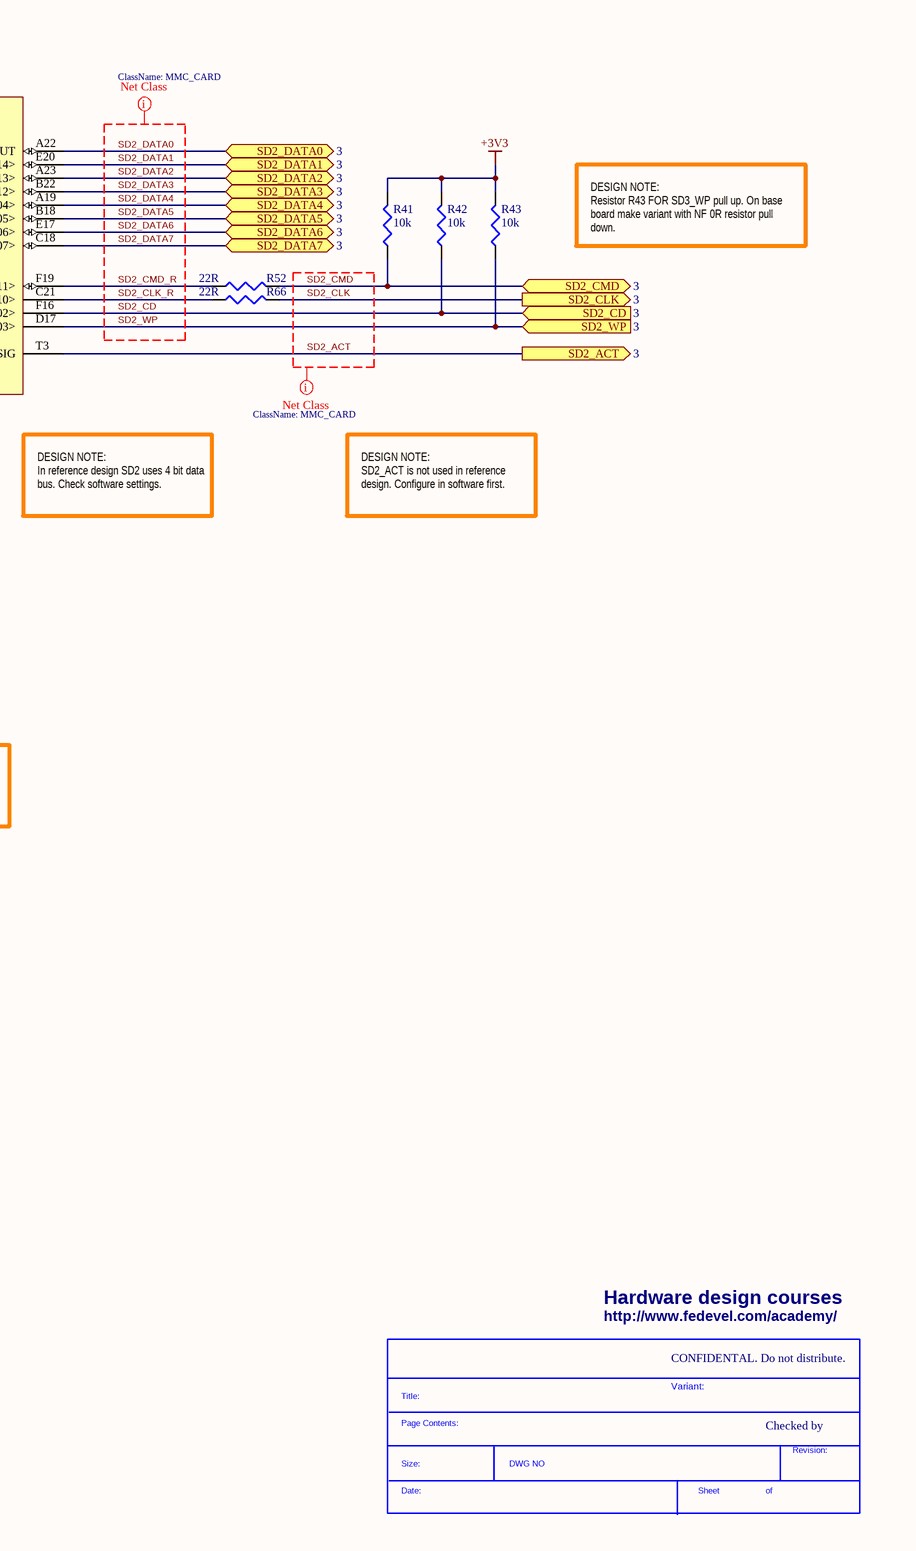
[diagram p9: [08] - CPU - SPI, I2C, SD, MMC.SchDoc, right]

### Parts
(Parts that share a designator on the sheet are numbered #1, #2 ... from top to bottom, then left to right.)
*#5  SDTitleBlock  (value not drawn)  (graphical)
R1  22R  [R0402]
R38  10k  [R0402]
R39  10k  [R0402]
R40  10k  [R0402]
R41  10k  [R0402]
R42  10k  [R0402]
R43  10k  [R0402]
R44  4k99  [R0402]
R45  4k99  [R0402]
R50  22R  [R0402]
R52  22R  [R0402]
R66  22R  [R0402]
R112  22R  [R0402]
R156  0R  [R0402]
R157  0R  [R0402]
R159  22R  [R0402]
U1  MCIMX6Q5EYM10AC  [PBGA624]  (parts J,K,L of 15)

### Ports
CPU_GPIO0 (bidir, see 3), CPU_GPIO1 (bidir, see 3), CSPI2_CLK (out, see 3), CSPI2_CS0 (out, see 3), CSPI2_MISO (in, see 3), CSPI2_MOSI (out, see 3), CSPI3_CLK (out, see 14), CSPI3_CS2 (out, see 14), CSPI3_MISO (in, see 14), CSPI3_MOSI (out, see 14), I2C3_SCL (see 3, 6), I2C3_SDA (bidir, see 3, 6), SD2_ACT (out, see 3), SD2_CD (in, see 3), SD2_CLK (out, see 3), SD2_CMD (bidir, see 3), SD2_DATA0 (bidir, see 3), SD2_DATA1 (bidir, see 3), SD2_DATA2 (bidir, see 3), SD2_DATA3 (bidir, see 3), SD2_DATA4 (bidir, see 3), SD2_DATA5 (bidir, see 3), SD2_DATA6 (bidir, see 3), SD2_DATA7 (bidir, see 3), SD2_WP (in, see 3), SD3_CD (in, see 3), SD3_CLK (out, see 3), SD3_CMD (bidir, see 3), SD3_DATA0 (bidir, see 3), SD3_DATA1 (bidir, see 3), SD3_DATA2 (bidir, see 3), SD3_DATA3 (bidir, see 3), SD3_WP (in, see 3)

### Nets
+3V3: R38.2 R39.2 R40.2 R41.2 R42.2 R43.2 R44.2 R45.2
CPU_GPIO0: R45.1 R157.1 U1.E15(NAND_WP_B_/_IPU2_SISG5_/_<GPIO6_IO09>) ; port CPU_GPIO0
CPU_GPIO1: R44.1 R156.1 U1.D16(NAND_CE3_B_/_IPU1_SISG1_/_ESAI_TX1_/_EIM_ADDR26_/_<GPIO6_IO16>_/_IPU2_SISG1) ; port CPU_GPIO1
CSPI2_CLK: R159.2 ; port CSPI2_CLK
CSPI2_CLK_R: R159.1 U1.U23(IPU1_DISP0_DATA19_/_IPU2_DISP0_DATA19_/_ECSPI2_SCLK_/_AUD5_RXD_/_AUD4_RXC_/_<GPIO5_IO13>_/_EIM_CS3)
CSPI2_CS0: U1.V25(IPU1_DISP0_DATA18_/_IPU2_DISP0_DATA18_/_ECSPI2_SS0_/_AUD5_TXFS_/_AUD4_RXFS_/_<GPIO5_IO12>_/_EIM_CS2) ; port CSPI2_CS0
CSPI2_MISO: U1.U24(IPU1_DISP0_DATA17_/_IPU2_DISP0_DATA17_/_ECSPI2_MISO_/_AUD5_TXD_/_SDMA_EXT_EVENT1_/_<GPIO5_IO11>) ; port CSPI2_MISO
CSPI2_MOSI: U1.T21(IPU1_DISP0_DATA16_/_IPU2_DISP0_DATA16_/_ECSPI2_MOSI_/_AUD5_TXC_/_SDMA_EXT_EVENT0_/_<GPIO5_IO10>) ; port CSPI2_MOSI
CSPI3_CLK: R112.2 ; port CSPI3_CLK
CSPI3_CLK_R: R112.1 U1.P24(IPU1_DISP0_DATA00_/_IPU2_DISP0_DATA00_/_ECSPI3_SCLK_/_<GPIO4_IO21>)
CSPI3_CS2: U1.R25(IPU1_DISP0_DATA05_/_IPU2_DISP0_DATA05_/_ECSPI3_SS2_/_AUD6_RXFS_/_<GPIO4_IO26>) ; port CSPI3_CS2
CSPI3_MISO: U1.P23(IPU1_DISP0_DATA02_/_IPU2_DISP0_DATA02_/_ECSPI3_MISO_/_<GPIO4_IO23>) ; port CSPI3_MISO
CSPI3_MOSI: U1.P22(IPU1_DISP0_DATA01_/_IPU2_DISP0_DATA01_/_ECSPI3_MOSI_/_<GPIO4_IO22>) ; port CSPI3_MOSI
I2C3_SCL: R157.2 ; port I2C3_SCL
I2C3_SDA: R156.2 ; port I2C3_SDA
SD2_ACT: U1.T3(ESAI_TX_CLK_/_I2C3_SDA_/_<GPIO1_IO06>_/_SD2_LCTL_/_MLB_SIG) ; port SD2_ACT
SD2_CD: R42.1 U1.F16(NAND_DATA02_/_SD1_DATA6_/_<GPIO2_IO02>) ; port SD2_CD
SD2_CLK: R66.2 ; port SD2_CLK
SD2_CLK_R: R66.1 U1.C21(SD2_CLK_/_ECSPI5_SCLK_/_KEY_COL5_/_AUD4_RXFS_/_<GPIO1_IO10>)
SD2_CMD: R41.1 R52.2 ; port SD2_CMD
SD2_CMD_R: R52.1 U1.F19(SD2_CMD_/_ECSPI5_MOSI_/_KEY_ROW5_/_AUD4_RXC_/_<GPIO1_IO11>)
SD2_DATA0: U1.A22(SD2_DATA0_/_ECSPI5_MISO_/_AUD4_RXD_/_KEY_ROW7_/_<GPIO1_IO15>_/_DCIC2_OUT) ; port SD2_DATA0
SD2_DATA1: U1.E20(SD2_DATA1_/_ECSPI5_SS0_/_EIM_CS2_/_AUD4_TXFS_/_KEY_COL7_/_<GPIO1_IO14>) ; port SD2_DATA1
SD2_DATA2: U1.A23(SD2_DATA2_/_ECSPI5_SS1_/_EIM_CS3_/_AUD4_TXD_/_KEY_ROW6_/_<GPIO1_IO13>) ; port SD2_DATA2
SD2_DATA3: U1.B22(SD2_DATA3_/_ECSPI5_SS3_/_KEY_COL6_/_AUD4_TXC_/_<GPIO1_IO12>) ; port SD2_DATA3
SD2_DATA4: U1.A19(NAND_DATA04_/_SD2_DATA4_/_<GPIO2_IO04>) ; port SD2_DATA4
SD2_DATA5: U1.B18(NAND_DATA05_/_SD2_DATA5_/_<GPIO2_IO05>) ; port SD2_DATA5
SD2_DATA6: U1.E17(NAND_DATA06_/_SD2_DATA6_/_<GPIO2_IO06>) ; port SD2_DATA6
SD2_DATA7: U1.C18(NAND_DATA07_/_SD2_DATA7_/_<GPIO2_IO07>) ; port SD2_DATA7
SD2_WP: R43.1 U1.D17(NAND_DATA03_/_SD1_DATA7_/_<GPIO2_IO03>) ; port SD2_WP
SD3_CD: R39.1 U1.A18(NAND_DATA00_/_SD1_DATA4_/_<GPIO2_IO00>) ; port SD3_CD
SD3_CLK: R50.2 ; port SD3_CLK
SD3_CLK_R: R50.1 U1.D14(SD3_CLK_/_UART2_RTS_B_/_FLEXCAN1_RX_/_<GPIO7_IO03>)
SD3_CMD: R1.2 R38.1 ; port SD3_CMD
SD3_CMD_R: R1.1 U1.B13(SD3_CMD_/_UART2_CTS_B_/_FLEXCAN1_TX_/_<GPIO7_IO02>)
SD3_DATA0: U1.E14(SD3_DATA0_/_UART1_CTS_B_/_FLEXCAN2_TX_/_<GPIO7_IO04>) ; port SD3_DATA0
SD3_DATA1: U1.F14(SD3_DATA1_/_UART1_RTS_B_/_FLEXCAN2_RX_/_<GPIO7_IO05>) ; port SD3_DATA1
SD3_DATA2: U1.A15(SD3_DATA2_/_<GPIO7_IO06>) ; port SD3_DATA2
SD3_DATA3: U1.B15(SD3_DATA3_/_UART3_CTS_B_/_<GPIO7_IO07>) ; port SD3_DATA3
SD3_WP: R40.1 U1.C17(NAND_DATA01_/_SD1_DATA5_/_<GPIO2_IO01>) ; port SD3_WP

Not connected (* = marked no-connect by the designer): U1 C13(SD3_DATA5_/_UART2_TX_DATA_/_<GPIO7_IO00>)* D13(SD3_DATA4_/_UART2_RX_DATA_/_<GPIO7_IO01>)* E13(SD3_DATA6_/_UART1_RX_DATA_/_<GPIO6_IO18>)* F13(SD3_DATA7_/_UART1_TX_DATA_/_<GPIO6_IO17>)* P20(IPU1_DISP0_DATA04_/_IPU2_DISP0_DATA04_/_ECSPI3_SS1_/_<GPIO4_IO25>)* P21(IPU1_DISP0_DATA03_/_IPU2_DISP0_DATA03_/_ECSPI3_SS0_/_<GPIO4_IO24>)* R23(IPU1_DISP0_DATA06_/_IPU2_DISP0_DATA06_/_ECSPI3_SS3_/_AUD6_RXC_/_<GPIO4_IO27>)*

### Layout directives
net class SPI3: CSPI3_CLK, CSPI3_CLK_R, CSPI3_CS2, CSPI3_MISO, CSPI3_MOSI
net class SPI2: CSPI2_CLK, CSPI2_CLK_R, CSPI2_CS0, CSPI2_MISO, CSPI2_MOSI
net class GPIO: CPU_GPIO0, CPU_GPIO1
net class SD_CARD: SD3_CD, SD3_CLK, SD3_CLK_R, SD3_CMD, SD3_CMD_R, SD3_DATA0, SD3_DATA1, SD3_DATA2, SD3_DATA3, SD3_WP
net class MMC_CARD: SD2_ACT, SD2_CD, SD2_CLK, SD2_CLK_R, SD2_CMD, SD2_CMD_R, SD2_DATA0, SD2_DATA1, SD2_DATA2, SD2_DATA3, SD2_DATA4, SD2_DATA5, SD2_DATA6, SD2_DATA7, SD2_WP

### Notes on the sheet
- CPU - SPI, I2C, SD, MMC
- SD-CARD
- DESIGN NOTE:
  Card detection pin:
  If not used,tie to low to indicate there is a card attached.
- MMC-CARD
- DESIGN NOTE:
  Card write protect detect
  If not used, tie to low to indicate it's not write protected.
- DESIGN NOTE:
  Resistor R40 for SD3_WP pull up. On base board make variant with NF 0R resistor pull down.
- DESIGN NOTE:
  Resistor R43 FOR SD3_WP pull up. On base board make variant with NF 0R resistor pull down.
- DESIGN NOTE:
  The maximum image size to load in SD/MMC boot is 32MB. (iMX6 reference manual)
- DESIGN NOTE:
  In reference design SD3 uses 8 bit data bus. Check software settings.
- DESIGN NOTE:
  In reference design SD2 uses 4 bit data bus. Check software settings.
- DESIGN NOTE:
  SD2_ACT is not used in reference design. Configure in software first.
- SPI FLASH, I2C
- DESIGN NOTE:
  CSPI3 needs to be configured in software first.
- DESIGN NOTE:
  CSPI2_MOSI needs to be configured in software first.
- DESIGN NOTE:
  iMX6 Quad doesn't support I2C4 therefore: emulate I2C4 by software or connect to I2C3.
  If connected to I2C3 do not populate pullups R44, R45.
- DESIGN NOTE:
  I2C4 is not used in reference design. Configure in software first.
- NF
- DESIGN NOTE:
  Usage of CPU_GPIO0 and CPU_GPIO1 pins:
  - as GPIO do not fit R156, R157. Pullups change to higher value or do not fit.
  - I2C4 do not fit R156 and R157. Needs to be configured in software.
  - I2C3 fit R156, R157 and do not fit R44, R45
- Hardware design courses
- http://www.fedevel.com/academy/
- CONFIDENTAL. Do not distribute.
- Variant:
- Checked by
- (in symbol MCIMX6Q5EYM10AC, part J) i.MX6Q - SD2
- (in symbol MCIMX6Q5EYM10AC, part K) i.MX6Q - SD3
- (in symbol MCIMX6Q5EYM10AC, part L) i.MX6Q - SPI, I2C; SPINOR; ECSPI2; I2C4
- (in symbol SDTitleBlock) Title:; Page Contents:; Revision:; Size:; DWG NO; Date:; Sheet; of

### Library data of the parts
R1 R50 R52 R66 R112 R159 = RC0402FR-0722RL: as R35 on sheet [07] - CPU - USB, ETHERNET; Category: Resistors; Supplier Part Number: 311-22.0LRCT-ND; Manufacturer Part Number: RC0402FR-0722RL; Package / Case: 0402 (1005 Metric); Price 1k [$]: 0.01421; Tolerance: ±1%; Value: 22R; .Checked SCH: used; Supplier: Digikey; Supplier 1: Digi-Key; Supplier Part Number 1: 311-22.0LRCT-ND; RoHS: RoHS Compliant; Stock 1: 943800; Pricing 1: 10=0.014, 50=0.0104, 100=0.0079, 250=0.00584, 500=0.00432, 1000=0.00288 (USD); Composition: Thick Film; Features: -; Size / Dimension: 0.039" L x 0.020" W (1.00mm x 0.50mm); Height: 0.016" (0.40mm); Number of Terminations: 2; Packaging: Cut Tape (CT); ComponentLink1URL: http://www.yageo.com/documents/recent/PYu-RC0402_51_RoHS_L_6.pdf; ComponentLink1Description: http://www.yageo.com/documents/recent/PYu-RC0402_51_RoHS_L_6.pdf
R38-R43 = RC0402FR-0710KL: as R33 on sheet [06] - CPU - HDMI, LVDS; Category: Resistors; Supplier Part Number: 311-10.0KLRCT-ND; Manufacturer Part Number: RC0402FR-0710KL; Package / Case: 0402 (1005 Metric); Price 1k [$]: 0.01421; Resistance (Ohms): 10K; Tolerance: ±1%; Value: 10k; .Checked SCH: used; Supplier: Digikey; Supplier 1: Digi-Key; Supplier Part Number 1: 311-10.0KLRCT-ND; RoHS: RoHS Compliant; Stock 1: 2916495; Pricing 1: 10=0.014, 50=0.0104, 100=0.0079, 250=0.00584, 500=0.00432, 1000=0.00288 (USD); Composition: Thick Film; Features: -; Size / Dimension: 0.039" L x 0.020" W (1.00mm x 0.50mm); Height: 0.016" (0.40mm); Number of Terminations: 2; Packaging: Cut Tape (CT); ComponentLink1URL: http://www.yageo.com/documents/recent/PYu-RC0402_51_RoHS_L_6.pdf; ComponentLink1Description: http://www.yageo.com/documents/recent/PYu-RC0402_51_RoHS_L_6.pdf
R44 R45 = RMCF0402FT4K99: as R28 on sheet [06] - CPU - HDMI, LVDS; Category: Resistors; Supplier Part Number: RMCF0402FT4K99CT-ND; Manufacturer Part Number: RMCF0402FT4K99; Package / Case: 0402 (1005 Metric); Price 1k [$]: 0.00384; Resistance (Ohms): 4.99K; Tolerance: ±1%; Value: 4k99; .Checked SCH: used; Supplier: Digikey; Supplier 1: Digi-Key; Supplier Part Number 1: RMCF0402FT4K99CT-ND; RoHS: RoHS Compliant; Stock 1: 48509; Pricing 1: 1=0.04, 10=0.025, 50=0.0138, 100=0.0105, 250=0.0078, 500=0.00576, 1000=0.00384 (USD); Composition: Thick Film; Features: -; Size / Dimension: 0.039" L x 0.020" W (1.00mm x 0.50mm); Height: 0.016" (0.40mm); Number of Terminations: 2; Packaging: Cut Tape (CT); ComponentLink1URL: http://www.seielect.com/Catalog/SEI-RMCF.pdf; ComponentLink1Description: http://www.seielect.com/Catalog/SEI-RMCF.pdf
R156 R157 = RC0402JR-070RL: as R23 on sheet [06] - CPU - HDMI, LVDS; Category: Resistors; Supplier Part Number: 311-0.0JRCT-ND; Manufacturer Part Number: RC0402JR-070RL; Package / Case: 0402 (1005 Metric); Price 1k [$]: 0.01389; Value: 0R; .Checked SCH: used; Supplier: Digikey; Supplier 1: Digi-Key; Supplier Part Number 1: 311-0.0JRCT-ND; RoHS: RoHS Compliant; Stock 1: 1106330; Pricing 1: 10=0.012, 50=0.009, 100=0.0069, 250=0.00512, 500=0.0038, 1000=0.00253 (USD); Composition: Thick Film; Features: -; Temperature Coefficient: -; Size / Dimension: 0.039" L x 0.020" W (1.00mm x 0.50mm); Height: 0.016" (0.40mm); Number of Terminations: 2; Packaging: Cut Tape (CT); ComponentLink1URL: http://www.yageo.com/documents/recent/PYu-RC0402_51_RoHS_L_6.pdf; ComponentLink1Description: http://www.yageo.com/documents/recent/PYu-RC0402_51_RoHS_L_6.pdf
U1 = MCIMX6Q5EYM10AC: as U1 on sheet [04] - CPU - DDR3, DDR3 MEM; Supplier 1: Digi-Key; Manufacturer Part Number: MCIMX6Q5EYM10AC; RoHS: RoHS Compliant; Category: Integrated Circuits (ICs); Stock 1: 0; Pricing 1: 1=54.98, 10=51.922, 25=48.868, 100=30.5424 (USD); Program Memory Size: -; EEPROM Size: -; Data Converters: -; Operating Temperature: -20°C ~ 105°C; Package / Case: 624-FBGA, FCBGA; Packaging: Tray; ComponentLink1URL: http://cache.freescale.com/files/32bit/doc/data_sheet/IMX6DQCEC.pdf; ComponentLink1Description: http://cache.freescale.com/files/32bit/doc/data_sheet/IMX6DQCEC.pdf; Supplier Part Number 1: MCIMX6Q5EYM10AC-ND; .Checked SCH: MM

## Sheet [09] - CPU - UART, AUDIO.SchDoc
size A2; DocumentNumber: 9; SheetNumber: 9; SheetTotal: 20
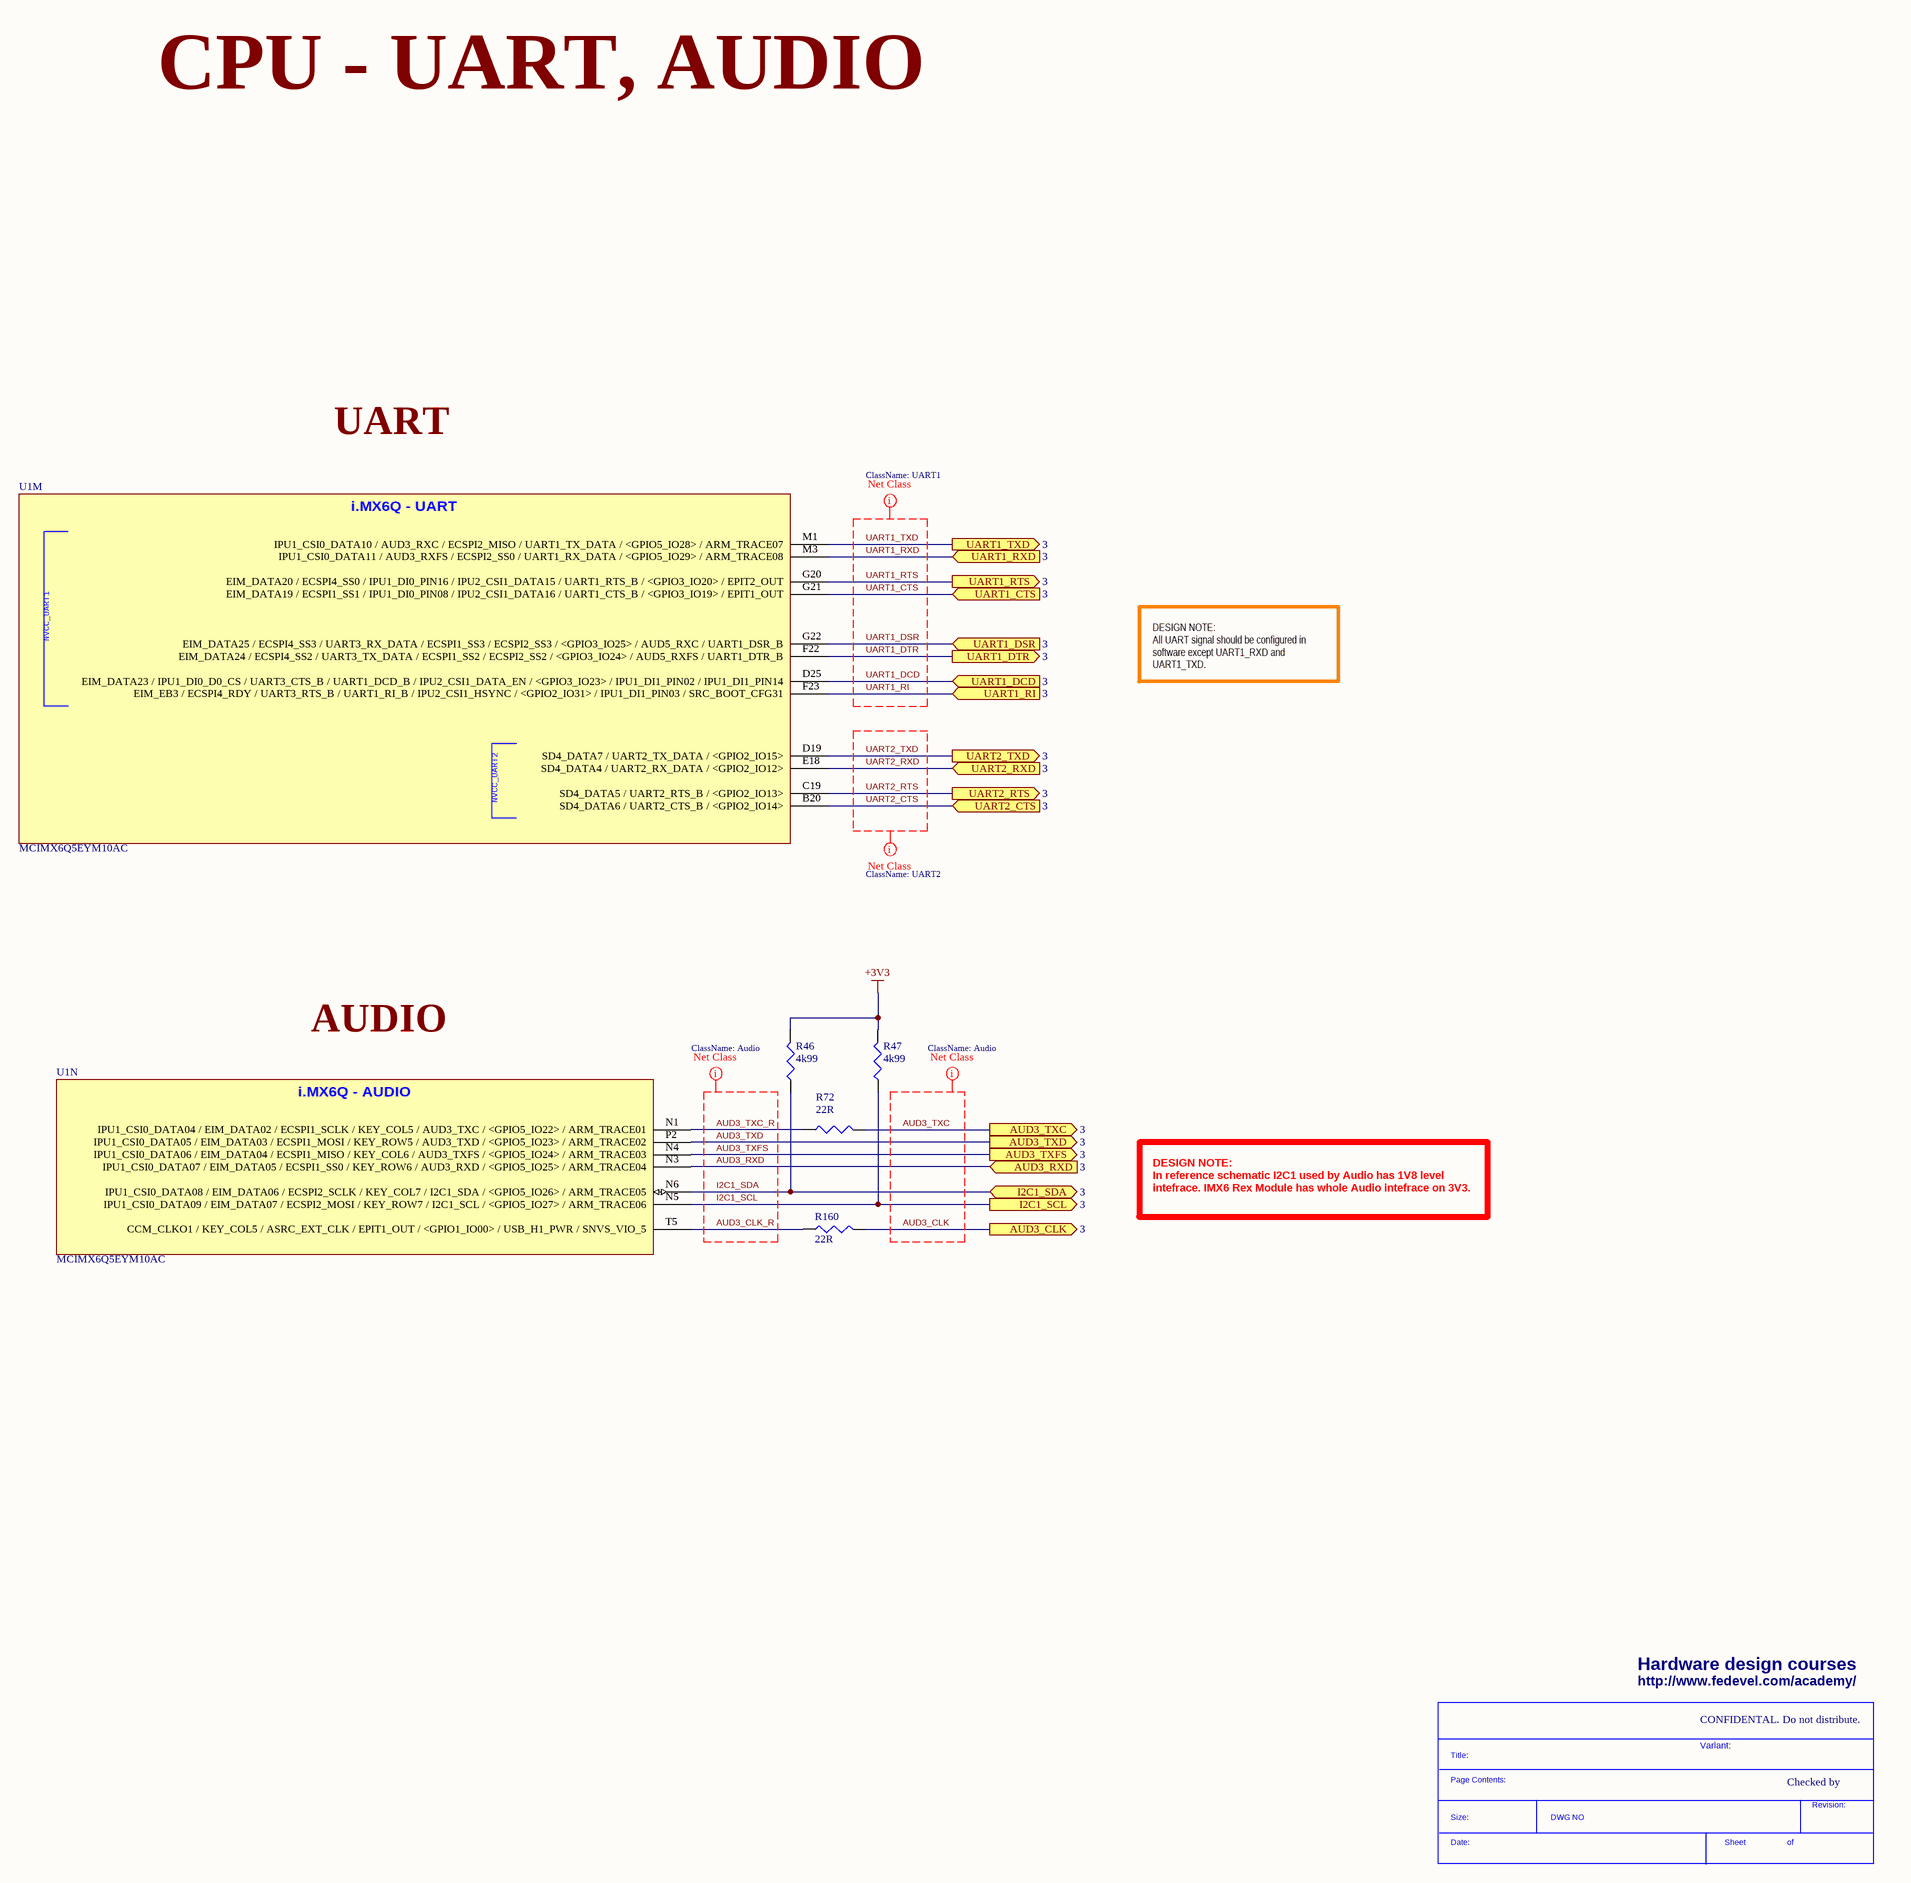
[diagram p10: [09] - CPU - UART, AUDIO.SchDoc]

### Parts
(Parts that share a designator on the sheet are numbered #1, #2 ... from top to bottom, then left to right.)
*#6  SDTitleBlock  (value not drawn)  (graphical)
R46  4k99  [R0402]
R47  4k99  [R0402]
R72  22R  [R0402]
R160  22R  [R0402]
U1  MCIMX6Q5EYM10AC  [PBGA624]  (parts M,N of 15)

### Ports
AUD3_CLK (out, see 3), AUD3_RXD (in, see 3), AUD3_TXC (out, see 3), AUD3_TXD (out, see 3), AUD3_TXFS (out, see 3), I2C1_SCL (out, see 3), I2C1_SDA (bidir, see 3), UART1_CTS (in, see 3), UART1_DCD (in, see 3), UART1_DSR (in, see 3), UART1_DTR (out, see 3), UART1_RI (in, see 3), UART1_RTS (out, see 3), UART1_RXD (in, see 3), UART1_TXD (out, see 3), UART2_CTS (in, see 3), UART2_RTS (out, see 3), UART2_RXD (in, see 3), UART2_TXD (out, see 3)

### Nets
+3V3: R46.2 R47.2
AUD3_CLK: R160.2 ; port AUD3_CLK
AUD3_CLK_R: R160.1 U1.T5(CCM_CLKO1_/_KEY_COL5_/_ASRC_EXT_CLK_/_EPIT1_OUT_/_<GPIO1_IO00>_/_USB_H1_PWR_/_SNVS_VIO_5)
AUD3_RXD: U1.N3(IPU1_CSI0_DATA07_/_EIM_DATA05_/_ECSPI1_SS0_/_KEY_ROW6_/_AUD3_RXD_/_<GPIO5_IO25>_/_ARM_TRACE04) ; port AUD3_RXD
AUD3_TXC: R72.2 ; port AUD3_TXC
AUD3_TXC_R: R72.1 U1.N1(IPU1_CSI0_DATA04_/_EIM_DATA02_/_ECSPI1_SCLK_/_KEY_COL5_/_AUD3_TXC_/_<GPIO5_IO22>_/_ARM_TRACE01)
AUD3_TXD: U1.P2(IPU1_CSI0_DATA05_/_EIM_DATA03_/_ECSPI1_MOSI_/_KEY_ROW5_/_AUD3_TXD_/_<GPIO5_IO23>_/_ARM_TRACE02) ; port AUD3_TXD
AUD3_TXFS: U1.N4(IPU1_CSI0_DATA06_/_EIM_DATA04_/_ECSPI1_MISO_/_KEY_COL6_/_AUD3_TXFS_/_<GPIO5_IO24>_/_ARM_TRACE03) ; port AUD3_TXFS
I2C1_SCL: R47.1 U1.N5(IPU1_CSI0_DATA09_/_EIM_DATA07_/_ECSPI2_MOSI_/_KEY_ROW7_/_I2C1_SCL_/_<GPIO5_IO27>_/_ARM_TRACE06) ; port I2C1_SCL
I2C1_SDA: R46.1 U1.N6(IPU1_CSI0_DATA08_/_EIM_DATA06_/_ECSPI2_SCLK_/_KEY_COL7_/_I2C1_SDA_/_<GPIO5_IO26>_/_ARM_TRACE05) ; port I2C1_SDA
UART1_CTS: U1.G21(EIM_DATA19_/_ECSPI1_SS1_/_IPU1_DI0_PIN08_/_IPU2_CSI1_DATA16_/_UART1_CTS_B_/_<GPIO3_IO19>_/_EPIT1_OUT) ; port UART1_CTS
UART1_DCD: U1.D25(EIM_DATA23_/_IPU1_DI0_D0_CS_/_UART3_CTS_B_/_UART1_DCD_B_/_IPU2_CSI1_DATA_EN_/_<GPIO3_IO23>_/_IPU1_DI1_PIN02_/_IPU1_DI1_PIN14) ; port UART1_DCD
UART1_DSR: U1.G22(EIM_DATA25_/_ECSPI4_SS3_/_UART3_RX_DATA_/_ECSPI1_SS3_/_ECSPI2_SS3_/_<GPIO3_IO25>_/_AUD5_RXC_/_UART1_DSR_B) ; port UART1_DSR
UART1_DTR: U1.F22(EIM_DATA24_/_ECSPI4_SS2_/_UART3_TX_DATA_/_ECSPI1_SS2_/_ECSPI2_SS2_/_<GPIO3_IO24>_/_AUD5_RXFS_/_UART1_DTR_B) ; port UART1_DTR
UART1_RI: U1.F23(EIM_EB3_/_ECSPI4_RDY_/_UART3_RTS_B_/_UART1_RI_B_/_IPU2_CSI1_HSYNC_/_<GPIO2_IO31>_/_IPU1_DI1_PIN03_/_SRC_BOOT_CFG31) ; port UART1_RI
UART1_RTS: U1.G20(EIM_DATA20_/_ECSPI4_SS0_/_IPU1_DI0_PIN16_/_IPU2_CSI1_DATA15_/_UART1_RTS_B_/_<GPIO3_IO20>_/_EPIT2_OUT) ; port UART1_RTS
UART1_RXD: U1.M3(IPU1_CSI0_DATA11_/_AUD3_RXFS_/_ECSPI2_SS0_/_UART1_RX_DATA_/_<GPIO5_IO29>_/_ARM_TRACE08) ; port UART1_RXD
UART1_TXD: U1.M1(IPU1_CSI0_DATA10_/_AUD3_RXC_/_ECSPI2_MISO_/_UART1_TX_DATA_/_<GPIO5_IO28>_/_ARM_TRACE07) ; port UART1_TXD
UART2_CTS: U1.B20(SD4_DATA6_/_UART2_CTS_B_/_<GPIO2_IO14>) ; port UART2_CTS
UART2_RTS: U1.C19(SD4_DATA5_/_UART2_RTS_B_/_<GPIO2_IO13>) ; port UART2_RTS
UART2_RXD: U1.E18(SD4_DATA4_/_UART2_RX_DATA_/_<GPIO2_IO12>) ; port UART2_RXD
UART2_TXD: U1.D19(SD4_DATA7_/_UART2_TX_DATA_/_<GPIO2_IO15>) ; port UART2_TXD

### Layout directives
net class UART1: UART1_CTS, UART1_DCD, UART1_DSR, UART1_DTR, UART1_RI, UART1_RTS, UART1_RXD, UART1_TXD
net class UART2: UART2_CTS, UART2_RTS, UART2_RXD, UART2_TXD
net class Audio: AUD3_CLK, AUD3_CLK_R, AUD3_RXD, AUD3_TXC, AUD3_TXC_R, AUD3_TXD, AUD3_TXFS, I2C1_SCL, I2C1_SDA

### Notes on the sheet
- CPU - UART, AUDIO
- UART
- DESIGN NOTE:
  All UART signal should be configured in software except UART1_RXD and UART1_TXD.
- AUDIO
- DESIGN NOTE:
  In reference schematic I2C1 used by Audio has 1V8 level intefrace. IMX6 Rex Module has whole Audio intefrace on 3V3.
- Hardware design courses
- http://www.fedevel.com/academy/
- CONFIDENTAL. Do not distribute.
- Variant:
- Checked by
- (in symbol MCIMX6Q5EYM10AC, part M) i.MX6Q - UART; NVCC_UART1; NVCC_UART2
- (in symbol MCIMX6Q5EYM10AC, part N) i.MX6Q - AUDIO
- (in symbol SDTitleBlock) Title:; Page Contents:; Revision:; Size:; DWG NO; Date:; Sheet; of

### Library data of the parts
R46 R47 = RMCF0402FT4K99: RES TF 4.99K OHM 1% 1/16W 0402; Manufacturer: Stackpole Electronics Inc; Power (Watts): 0.063W, 1/16W; .Checked PCB: used; Temperature Coefficient: ±100ppm/°C; Category: Resistors; Supplier Part Number: RMCF0402FT4K99CT-ND; Manufacturer Part Number: RMCF0402FT4K99; Package / Case: 0402 (1005 Metric); Price 1k [$]: 0.00384; Resistance (Ohms): 4.99K; Tolerance: ±1%; Value: 4k99; .Checked SCH: used; Supplier: Digikey; Supplier 1: Digi-Key; Supplier Part Number 1: RMCF0402FT4K99CT-ND; RoHS: RoHS Compliant; Stock 1: 48509; Pricing 1: 1=0.04, 10=0.025, 50=0.0138, 100=0.0105, 250=0.0078, 500=0.00576, 1000=0.00384 (USD); Composition: Thick Film; Features: -; Size / Dimension: 0.039" L x 0.020" W (1.00mm x 0.50mm); Height: 0.016" (0.40mm); Number of Terminations: 2; Packaging: Cut Tape (CT); ComponentLink1URL: http://www.seielect.com/Catalog/SEI-RMCF.pdf; ComponentLink1Description: http://www.seielect.com/Catalog/SEI-RMCF.pdf
R72 R160 = RC0402FR-0722RL: RES 22.0 OHM 1/16W 1% 0402 SMD; Manufacturer: Yageo; Resistance (Ohms): 22; Power (Watts): 0.063W, 1/16W; .Checked PCB: used; Temperature Coefficient: ±100ppm/°C; Category: Resistors; Supplier Part Number: 311-22.0LRCT-ND; Manufacturer Part Number: RC0402FR-0722RL; Package / Case: 0402 (1005 Metric); Price 1k [$]: 0.01421; Tolerance: ±1%; Value: 22R; .Checked SCH: used; Supplier: Digikey; Supplier 1: Digi-Key; Supplier Part Number 1: 311-22.0LRCT-ND; RoHS: RoHS Compliant; Stock 1: 943800; Pricing 1: 10=0.014, 50=0.0104, 100=0.0079, 250=0.00584, 500=0.00432, 1000=0.00288 (USD); Composition: Thick Film; Features: -; Size / Dimension: 0.039" L x 0.020" W (1.00mm x 0.50mm); Height: 0.016" (0.40mm); Number of Terminations: 2; Packaging: Cut Tape (CT); ComponentLink1URL: http://www.yageo.com/documents/recent/PYu-RC0402_51_RoHS_L_6.pdf; ComponentLink1Description: http://www.yageo.com/documents/recent/PYu-RC0402_51_RoHS_L_6.pdf
U1 = MCIMX6Q5EYM10AC: IC MCU 32BIT ARM QUAD 624FCBGA; Manufacturer: Freescale Semiconductor; Core Processor: ARM® Cortex™-A9; Core Size: 32-Bit Quad-Core; Speed: 1.0GHz; Connectivity: CAN, EBI/EMI, ESAI, Ethernet, GPMI, I2C, MMC/SD, PCI, SATA, SPI, UART, USB, USB OTG; Peripherals: DMA, HDMI, I2S/SSI/AC97, MIPI CSI, MIMI DSI, MIPI HIS, PWM, WDT; Number of I /O: 224; Program Memory Type: External Program Memory; RAM Size: 256K x 8; Voltage - Supply (Vcc/Vdd): 0.925 V ~ 1.5 V; Oscillator Type: Internal; .Creator: MM; .Checked PCB: MM, checked by RF; Supplier 1: Digi-Key; Manufacturer Part Number: MCIMX6Q5EYM10AC; RoHS: RoHS Compliant; Category: Integrated Circuits (ICs); Stock 1: 0; Pricing 1: 1=54.98, 10=51.922, 25=48.868, 100=30.5424 (USD); Program Memory Size: -; EEPROM Size: -; Data Converters: -; Operating Temperature: -20°C ~ 105°C; Package / Case: 624-FBGA, FCBGA; Packaging: Tray; ComponentLink1URL: http://cache.freescale.com/files/32bit/doc/data_sheet/IMX6DQCEC.pdf; ComponentLink1Description: http://cache.freescale.com/files/32bit/doc/data_sheet/IMX6DQCEC.pdf; Supplier Part Number 1: MCIMX6Q5EYM10AC-ND; .Checked SCH: MM